# Altium project RPL_POWER.PrjPcb (part 1 of 2)
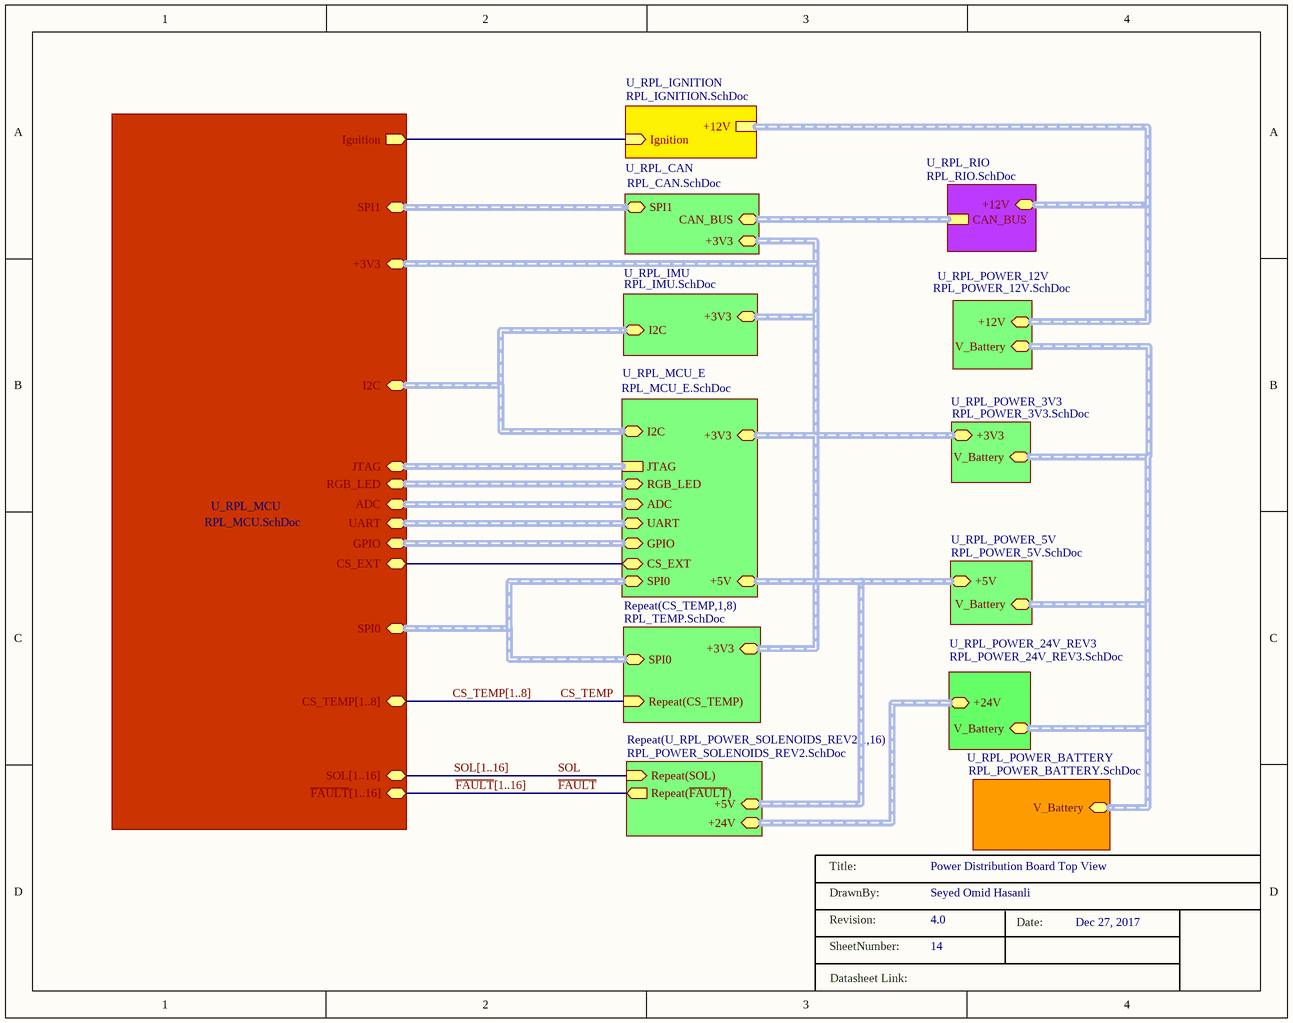
[diagram p0: RPL_MAP.SchDoc]
14 sheets, 328 parts. Net scope: hierarchical (ports join the sheet entries above them; power ports are global).
Board file: RPL_POWER.PcbDoc
Sheets:
  RPL_MAP.SchDoc
    U_RPL_POWER_24V_REV3 = RPL_POWER_24V_REV3.SchDoc
    U_RPL_POWER_3V3 = RPL_POWER_3V3.SchDoc
    U_RPL_POWER_5V = RPL_POWER_5V.SchDoc
    U_RPL_POWER_12V = RPL_POWER_12V.SchDoc
    U_RPL_MCU = RPL_MCU.SchDoc
    U_RPL_POWER_SOLENOIDS_REV21 = RPL_POWER_SOLENOIDS_REV2.SchDoc
    U_RPL_POWER_SOLENOIDS_REV22 = RPL_POWER_SOLENOIDS_REV2.SchDoc
    U_RPL_POWER_SOLENOIDS_REV23 = RPL_POWER_SOLENOIDS_REV2.SchDoc
    U_RPL_POWER_SOLENOIDS_REV24 = RPL_POWER_SOLENOIDS_REV2.SchDoc
    U_RPL_POWER_SOLENOIDS_REV25 = RPL_POWER_SOLENOIDS_REV2.SchDoc
    U_RPL_POWER_SOLENOIDS_REV26 = RPL_POWER_SOLENOIDS_REV2.SchDoc
    U_RPL_POWER_SOLENOIDS_REV27 = RPL_POWER_SOLENOIDS_REV2.SchDoc
    U_RPL_POWER_SOLENOIDS_REV28 = RPL_POWER_SOLENOIDS_REV2.SchDoc
    U_RPL_POWER_SOLENOIDS_REV29 = RPL_POWER_SOLENOIDS_REV2.SchDoc
    U_RPL_POWER_SOLENOIDS_REV210 = RPL_POWER_SOLENOIDS_REV2.SchDoc
    U_RPL_POWER_SOLENOIDS_REV211 = RPL_POWER_SOLENOIDS_REV2.SchDoc
    U_RPL_POWER_SOLENOIDS_REV212 = RPL_POWER_SOLENOIDS_REV2.SchDoc
    U_RPL_POWER_SOLENOIDS_REV213 = RPL_POWER_SOLENOIDS_REV2.SchDoc
    U_RPL_POWER_SOLENOIDS_REV214 = RPL_POWER_SOLENOIDS_REV2.SchDoc
    U_RPL_POWER_SOLENOIDS_REV215 = RPL_POWER_SOLENOIDS_REV2.SchDoc
    U_RPL_POWER_SOLENOIDS_REV216 = RPL_POWER_SOLENOIDS_REV2.SchDoc
    CS_TEMP1 = RPL_TEMP.SchDoc
    CS_TEMP2 = RPL_TEMP.SchDoc
    CS_TEMP3 = RPL_TEMP.SchDoc
    CS_TEMP4 = RPL_TEMP.SchDoc
    CS_TEMP5 = RPL_TEMP.SchDoc
    CS_TEMP6 = RPL_TEMP.SchDoc
    CS_TEMP7 = RPL_TEMP.SchDoc
    CS_TEMP8 = RPL_TEMP.SchDoc
    U_RPL_IMU = RPL_IMU.SchDoc
    U_RPL_CAN = RPL_CAN.SchDoc
    U_RPL_MCU_E = RPL_MCU_E.SchDoc
    U_RPL_POWER_BATTERY = RPL_POWER_BATTERY.SchDoc
    U_RPL_RIO = RPL_RIO.SchDoc
    U_RPL_IGNITION = RPL_IGNITION.SchDoc

## Sheet RPL_MAP.SchDoc: Power Distribution Board Top View
size A; Date: Dec 27, 2017; DrawnBy: Seyed Omid Hasanli; Revision: 4.0; SheetNumber: 14

### Sub-sheets
Repeat(CS_TEMP,1,8) = RPL_TEMP.SchDoc: Repeat(CS_TEMP) (in), +3V3 (harness +3V3), SPI0 (harness SPI0)
Repeat(U_RPL_POWER_SOLENOIDS_REV2,1,16) = RPL_POWER_SOLENOIDS_REV2.SchDoc: Repeat(SOL) (in), Repeat(~{FAULT}) (out), +5V (harness +5V), +24V (harness +24V)
U_RPL_CAN = RPL_CAN.SchDoc: CAN_BUS (harness CAN), SPI1 (harness SPI1), +3V3 (harness +3V3)
U_RPL_IGNITION = RPL_IGNITION.SchDoc: +12V (harness +12V), Ignition (in)
U_RPL_IMU = RPL_IMU.SchDoc: I2C (harness I2C), +3V3 (harness +3V3)
U_RPL_MCU = RPL_MCU.SchDoc: ~{FAULT}[1..16], SOL[1..16], CS_TEMP[1..8], UART (harness UART), JTAG (harness JTAG), ADC (harness ADC), RGB_LED (harness RGB_LED), GPIO (harness GPIO), SPI0 (harness SPI0), SPI1 (harness SPI1), I2C (harness I2C), +3V3 (harness +3V3), CS_EXT (bidir), Ignition (out)
U_RPL_MCU_E = RPL_MCU_E.SchDoc: JTAG (harness JTAG), RGB_LED (harness RGB_LED), ADC (harness ADC), UART (harness UART), CS_EXT, GPIO (harness GPIO), I2C (harness I2C), SPI0 (harness SPI0), +3V3 (harness +3V3), +5V (harness +5V)
U_RPL_POWER_3V3 = RPL_POWER_3V3.SchDoc: +3V3 (harness +3V3), V_Battery (harness V_Battery)
U_RPL_POWER_5V = RPL_POWER_5V.SchDoc: +5V (harness +5V), V_Battery (harness V_Battery)
U_RPL_POWER_12V = RPL_POWER_12V.SchDoc: +12V (harness +12V), V_Battery (harness V_Battery)
U_RPL_POWER_24V_REV3 = RPL_POWER_24V_REV3.SchDoc: +24V (harness +24V), V_Battery (harness V_Battery)
U_RPL_POWER_BATTERY = RPL_POWER_BATTERY.SchDoc: V_Battery (harness V_Battery)
U_RPL_RIO = RPL_RIO.SchDoc: CAN_BUS (harness CAN), +12V (harness +12V)

### Nets
CS_TEMP: sheet Repeat(CS_TEMP,1,8)/Repeat(CS_TEMP)
~{FAULT}: sheet Repeat(U_RPL_POWER_SOLENOIDS_REV2,1,16)/Repeat(~{FAULT})
SOL: sheet Repeat(U_RPL_POWER_SOLENOIDS_REV2,1,16)/Repeat(SOL)
NetJ1_10_3: sheet U_RPL_MCU/CS_EXT, sheet U_RPL_MCU_E/CS_EXT
NetR1_13_1: sheet U_RPL_MCU/Ignition, sheet U_RPL_IGNITION/Ignition

### Buses and harness runs
bus CS_TEMP[1..8] = sheet U_RPL_MCU/CS_TEMP[1..8]
bus SOL[1..16] = sheet U_RPL_MCU/SOL[1..16]
bus ~{FAULT}[1..16] = sheet U_RPL_MCU/~{FAULT}[1..16]
harness sheet Repeat(CS_TEMP,1,8)/+3V3 = sheet U_RPL_CAN/+3V3 = sheet U_RPL_IMU/+3V3 = sheet U_RPL_MCU/+3V3 = sheet U_RPL_MCU_E/+3V3 = sheet U_RPL_POWER_3V3/+3V3
harness sheet Repeat(CS_TEMP,1,8)/SPI0 = sheet U_RPL_MCU/SPI0 = sheet U_RPL_MCU_E/SPI0
harness sheet Repeat(U_RPL_POWER_SOLENOIDS_REV2,1,16)/+5V = sheet U_RPL_MCU_E/+5V = sheet U_RPL_POWER_5V/+5V
harness sheet Repeat(U_RPL_POWER_SOLENOIDS_REV2,1,16)/+24V = sheet U_RPL_POWER_24V_REV3/+24V
harness sheet U_RPL_CAN/CAN_BUS = sheet U_RPL_RIO/CAN_BUS
harness sheet U_RPL_CAN/SPI1 = sheet U_RPL_MCU/SPI1
harness sheet U_RPL_IGNITION/+12V = sheet U_RPL_POWER_12V/+12V = sheet U_RPL_RIO/+12V
harness sheet U_RPL_IMU/I2C = sheet U_RPL_MCU/I2C = sheet U_RPL_MCU_E/I2C
harness sheet U_RPL_MCU/ADC = sheet U_RPL_MCU_E/ADC
harness sheet U_RPL_MCU/GPIO = sheet U_RPL_MCU_E/GPIO
harness sheet U_RPL_MCU/JTAG = sheet U_RPL_MCU_E/JTAG
harness sheet U_RPL_MCU/RGB_LED = sheet U_RPL_MCU_E/RGB_LED
harness sheet U_RPL_MCU/UART = sheet U_RPL_MCU_E/UART
harness sheet U_RPL_POWER_3V3/V_Battery = sheet U_RPL_POWER_5V/V_Battery = sheet U_RPL_POWER_12V/V_Battery = sheet U_RPL_POWER_24V_REV3/V_Battery = sheet U_RPL_POWER_BATTERY/V_Battery

### Notes on the sheet
- Title:
- DrawnBy:
- Revision:
- SheetNumber:
- Date:
- Datasheet Link:

## Sheet RPL_POWER_24V_REV3.SchDoc: Boost-Buck Controller +24DC/ 3A
size A; Date: Dec 17 2017; DrawnBy: Seyed Omid Hasanli; Revision: 4.0; SheetNumber: 1
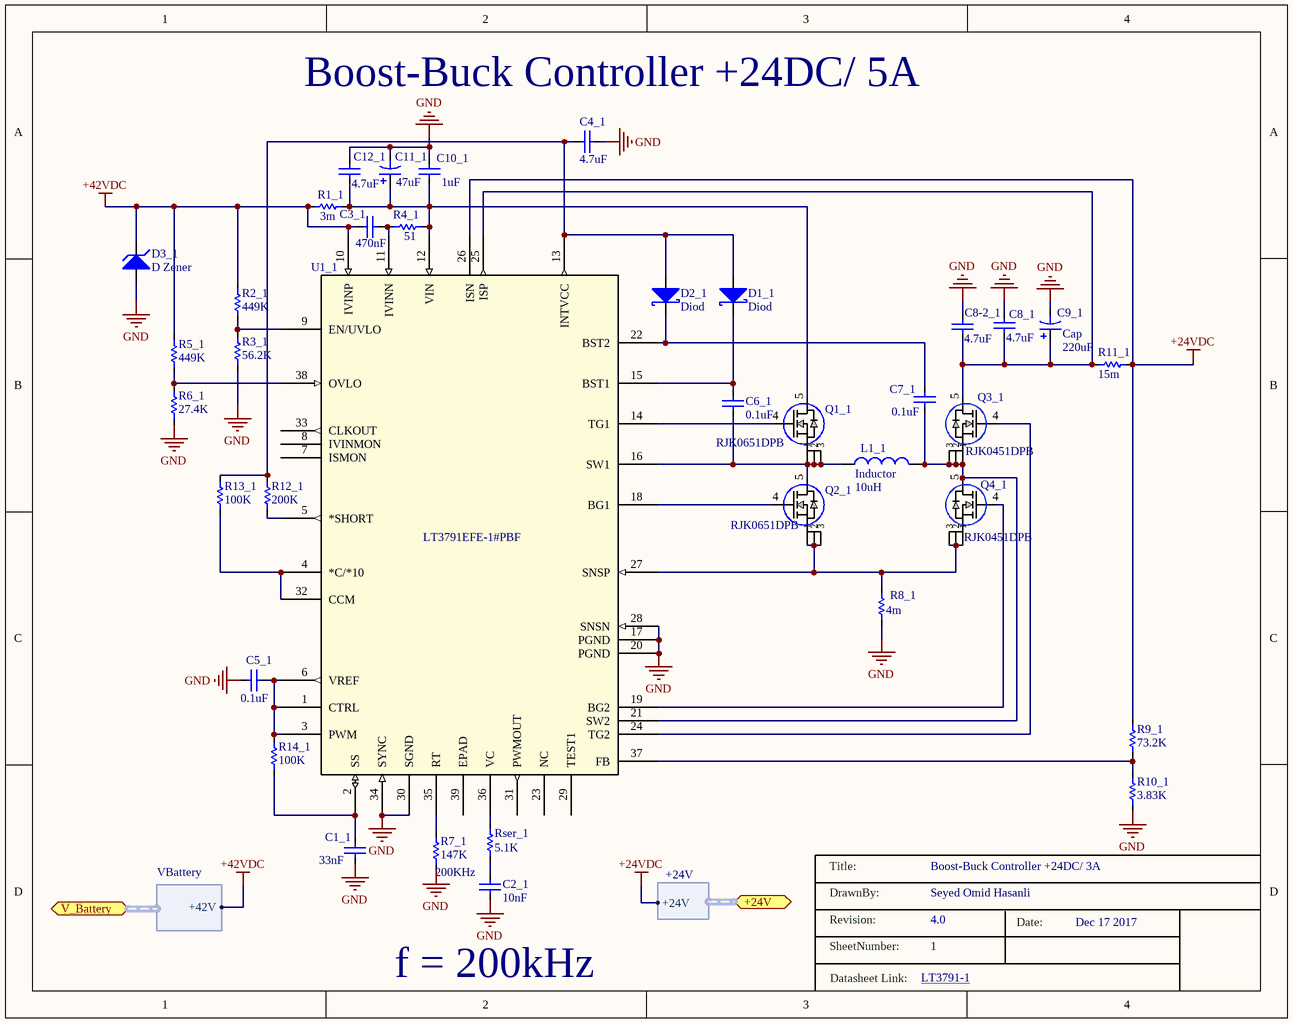
[diagram p1: RPL_POWER_24V_REV3.SchDoc]

### Parts
C1_1  value 33nF  [C1206C475K5PACTU]  (hidden comment: Cap)
C2_1  value 10nF  [C0805C475K9RACAUTO]  (hidden comment: Rser=5.1K)
C3_1  value 470nF  [C0805C475K9RACAUTO]  (hidden comment: Cap)
C4_1  value 4.7uF  [C0805C475K9RACAUTO]  (hidden comment: Cap)
C5_1  value 0.1uF  [C0805C475K9RACAUTO]  (hidden comment: Cap)
C6_1  value 0.1uF  [C0805C475K9RACAUTO]  (hidden comment: Cap)
C7_1  value 0.1uF  [C0805C475K9RACAUTO]  (hidden comment: Cap)
C8-2_1  value 4.7uF  [C1206C475K5PACTU]  (hidden comment: Cap)
C8_1  value 4.7uF  [C1206C475K5PACTU]  (hidden comment: Cap)
C9_1  Cap  value 220uF  [EEE_FK1V221AP]
C10_1  value 1uF  [C0805C475K9RACAUTO]  (hidden comment: Cap)
C11_1  value 47uF  [EEH_ZC1K470P]  (hidden comment: Cap)
C12_1  value 4.7uF  [C0805C475K9RACAUTO]  (hidden comment: Cap)
D1_1  Diod  [SODFL250X80-2N]
D2_1  Diod  [SODFL250X80-2N]
D3_1  D Zener  [SMAJ30A-TP]
L1_1  Inductor  value 10uH  [SER1360-103KLB]
Q1_1  RJK0651DPB  [LFPAK]
Q2_1  RJK0651DPB  [LFPAK]
Q3_1  RJK0451DPB  [LFPAK]
Q4_1  RJK0451DPB  [LFPAK]
R1_1  value 3m  [WSL12063L000FEA(1206)]  (hidden comment: Res)
R2_1  value 449K  [RES 0805]  (hidden comment: Res)
R3_1  value 56.2K  [RES 0805]  (hidden comment: Res)
R4_1  value 51  [RES 0805]  (hidden comment: Res)
R5_1  value 449K  [PTN1206E4993BBT1(1206)]  (hidden comment: Res)
R6_1  value 27.4K  [RES 0805]  (hidden comment: Res)
R7_1  200KHz  value 147K  [RES 0805]
R8_1  value 4m  [RES 0805]  (hidden comment: Res)
R9_1  value 73.2K  [RES 0805]  (hidden comment: Res)
R10_1  value 3.83K  [RES 0805]  (hidden comment: Res)
R11_1  value 15m  [WSL2010R0150FEA(2010)]  (hidden comment: Res)
R12_1  value 200K  [RES 0805]  (hidden comment: Res)
R13_1  value 100K  [RES 0805]  (hidden comment: Res)
R14_1  value 100K  [RES 0805]  (hidden comment: Res)
Rser_1  value 5.1K  [RES 0805]  (hidden comment: Res)
U1_1  LT3791EFE-1#PBF  [TSSOP-38_FE/AA]

### Ports
+24V (harness +24V), V_Battery (harness VBattery)

### Harnesses
VBattery: +42V
+24V: +24V

### Nets
+24VDC: R9_1.2 R11_1.2 U1_1.26(ISN) ; port +24V.+24V  [project net +24V]
+42VDC: C3_1.1 D3_1.2(K) R1_1.1 R2_1.2 R5_1.2 U1_1.10(IVINP) ; port V_Battery.+42V
GND: C1_1.1 C2_1.1 C4_1.1 C5_1.1 C8-2_1.2 C8_1.2 C9_1.2 C10_1.2 C11_1.2 C12_1.2 D3_1.1(A) R3_1.1 R6_1.1 R7_1.1 R8_1.1 R10_1.1 U1_1.17(PGND) U1_1.20(PGND) U1_1.28(SNSN) U1_1.30(SGND) U1_1.34(SYNC)
NetC1_1_2: C1_1.2 R14_1.1 U1_1.2(SS)
NetC2_1_2: C2_1.2 Rser_1.1
NetC3_1_2: C3_1.2 R4_1.1 U1_1.11(IVINN)
NetC4_1_2: C4_1.2 D1_1.1(A) D2_1.1(A) R12_1.2 R13_1.2 U1_1.13(INTVCC)
NetC5_1_2: C5_1.2 R14_1.2 U1_1.1(CTRL) U1_1.3(PWM) U1_1.6(VREF)
NetC6_1_1: C6_1.1 L1_1.1 Q1_1.1 Q1_1.2 Q1_1.3 Q2_1.5 U1_1.16(SW1)
NetC6_1_2: C6_1.2 D1_1.2(K) U1_1.15(BST1)
NetC7_1_1: C7_1.1 L1_1.2 Q3_1.1 Q3_1.2 Q3_1.3 Q4_1.5 U1_1.21(SW2)
NetC7_1_2: C7_1.2 D2_1.2(K) U1_1.22(BST2)
NetC8-2_1_1: C8-2_1.1 C8_1.1 C9_1.1 Q3_1.5 R11_1.1 U1_1.25(ISP)
NetC10_1_1: C10_1.1 C11_1.1 C12_1.1 Q1_1.5 R1_1.2 R4_1.2 U1_1.12(VIN)
NetQ1_1_4: Q1_1.4 U1_1.14(TG1)
NetQ2_1_1: Q2_1.1 Q2_1.2 Q2_1.3 Q4_1.1 Q4_1.2 Q4_1.3 R8_1.2 U1_1.27(SNSP)
NetQ2_1_4: Q2_1.4 U1_1.18(BG1)
NetQ3_1_4: Q3_1.4 U1_1.24(TG2)
NetQ4_1_4: Q4_1.4 U1_1.19(BG2)
NetR2_1_1: R2_1.1 R3_1.2 U1_1.9(EN/UVLO)
NetR5_1_1: R5_1.1 R6_1.2 U1_1.38(OVLO)
NetR7_1_2: R7_1.2 U1_1.35(RT)
NetR9_1_1: R9_1.1 R10_1.2 U1_1.37(FB)
NetR12_1_1: R12_1.1 U1_1.5(*SHORT)
NetR13_1_1: R13_1.1 U1_1.4(*C/*10) U1_1.32(CCM)
NetRser_1_2: Rser_1.2 U1_1.36(VC)

Not connected (* = marked no-connect by the designer): U1_1 7(ISMON) 8(IVINMON) 23(NC) 29(TEST1) 31(PWMOUT) 33(CLKOUT) 39(EPAD)

### Notes on the sheet
- Boost-Buck Controller +24DC/ 5A
- (near C2_1) f = 200kHz
- LT3791-1 <http://cds.linear.com/docs/en/datasheet/37911fb.pdf>
- Title:
- DrawnBy:
- Revision:
- SheetNumber:
- Date:
- Datasheet Link:

### Library data of the parts
C2_1 = Cap
C9_1 C11_1 = Cap Elec
D3_1 = D Zener: Zener Diode; Published: 8-Jun-2000; LatestRevisionDate: 17-Jul-2002; LatestRevisionNote: Re-released for DXP Platform.; PackageReference: DIODE-0.7; Publisher: Altium Limited; PackageDescription: Diode, Thru-Hole; 2 Leads; 0.7 in Pin Spacing
Q1_1 Q2_1 = RJK0651DPB-00#J5: Imported; Vendor: Renesas; VDSS_(V): 60; VGSS_(V): +/-20; ID_(A)@25C: 25; Pch(W): 45; Rds(on)@VGS: 10V,[8.0V]Max=14; QGD_(nC): 3.7; QG_(nC): 15; RG_(?): 0.7; Manufacturer_Part_Number: RJK0651DPB-00#J5; DatasheetLink: http://www.renesas.com/request?SCREEN_ID=ViewDocumentSearch&EXECUTE_ACTION=search&KEY_WORD=RJK0651DPB-00#J5; PartType: MOSFET MV; Package: LFPAK; Manufacturer_Name: Renesas; Value: Value
Q3_1 Q4_1 = RJK0451DPB-00#J5: Imported; Vendor: Renesas; VDSS_(V): 40; VGSS_(V): +/-20; ID_(A)@25C: 35; Pch(W): 45; Rds(on)@VGS: 10V,[8.0V]Max=7; QGD_(nC): 3; QG_(nC): 14; RG_(?): 0.7; Manufacturer_Part_Number: RJK0451DPB-00#J5; DatasheetLink: http://www.renesas.com/request?SCREEN_ID=ViewDocumentSearch&EXECUTE_ACTION=search&KEY_WORD=RJK0451DPB-00#J5; PartType: MOSFET MV; Package: LFPAK; Manufacturer_Name: Renesas; Value: Value
R7_1 = Res
U1_1 = LT3791EFE-1#PBF: Imported; Vendor: Linear Technology; Manufacturer_Part_Number: lt3791efe-1#pbf; Value: Value; Type: Type; RefDes: RefDes

## Sheet RPL_POWER_3V3.SchDoc: Step-Down Switching Regulater +5VDC to +3V3DC
size A; Date: Dec 17, 2017; DrawnBy: Seyed Omid Hasanli; Revision: 1.0; SheetNumber: 4
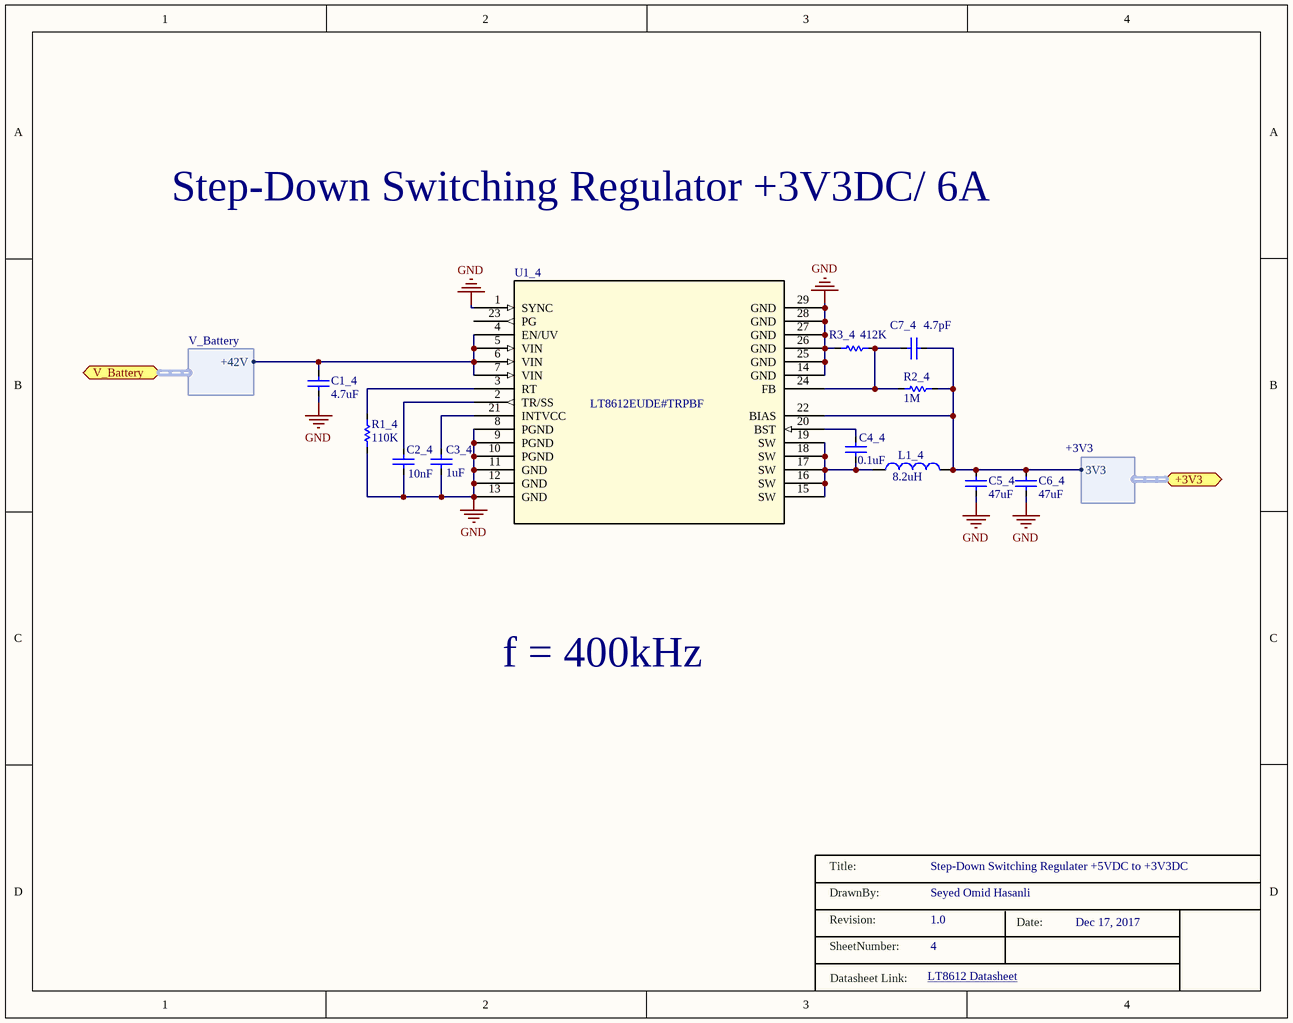
[diagram p2: RPL_POWER_3V3.SchDoc]

### Parts
C1_4  value 4.7uF  [C0805C475K9RACAUTO]  (hidden comment: Cap)
C2_4  value 10nF  [C0805C475K9RACAUTO]  (hidden comment: Cap)
C3_4  value 1uF  [C0805C475K9RACAUTO]  (hidden comment: Cap)
C4_4  value 0.1uF  [C0805C475K9RACAUTO]  (hidden comment: Cap)
C5_4  value 47uF  [C0805C475K9RACAUTO]  (hidden comment: Cap)
C6_4  value 47uF  [C0805C475K9RACAUTO]  (hidden comment: Cap)
C7_4  value 4.7pF  [C0805C475K9RACAUTO]  (hidden comment: Cap)
L1_4  value 8.2uH  [74404063082]  (hidden comment: Inductor)
R1_4  value 110K  [RES 0805]  (hidden comment: Res)
R2_4  value 1M  [RES 0805]  (hidden comment: Res)
R3_4  value 412K  [RES 0805]  (hidden comment: Res)
U1_4  LT8612EUDE#TRPBF  [QFN-28_UDE-M]

### Ports
+3V3 (harness +3V3), V_Battery (harness V_Battery)

### Harnesses
+3V3: 3V3
V_Battery: +42V

### Nets
+3V3: C5_4.2 C6_4.2 C7_4.2 L1_4.2 R2_4.2 U1_4.22(BIAS) ; port +3V3.3V3
+42VDC: C1_4.2 U1_4.4(EN/UV) U1_4.5(VIN) U1_4.6(VIN) U1_4.7(VIN) ; port V_Battery.+42V
GND: C1_4.1 C2_4.1 C3_4.1 C5_4.1 C6_4.1 R1_4.1 R3_4.2 U1_4.1(SYNC) U1_4.8(PGND) U1_4.9(PGND) U1_4.10(PGND) U1_4.11(GND) U1_4.12(GND) U1_4.13(GND) U1_4.14(GND) U1_4.25(GND) U1_4.26(GND) U1_4.27(GND) U1_4.28(GND) U1_4.29(GND)
NetC2_4_2: C2_4.2 U1_4.2(TR/SS)
NetC3_4_2: C3_4.2 U1_4.21(INTVCC)
NetC4_4_1: C4_4.1 L1_4.1 U1_4.15(SW) U1_4.16(SW) U1_4.17(SW) U1_4.18(SW) U1_4.19(SW)
NetC4_4_2: C4_4.2 U1_4.20(BST)
NetC7_4_1: C7_4.1 R2_4.1 R3_4.1 U1_4.24(FB)
NetR1_4_2: R1_4.2 U1_4.3(RT)

Not connected (* = marked no-connect by the designer): U1_4 23(PG)

### Notes on the sheet
- Step-Down Switching Regulator +3V3DC/ 6A
- f = 400kHz
- LT8612 Datasheet <http://cds.linear.com/docs/en/datasheet/8612fa.pdf>
- Title:
- DrawnBy:
- Revision:
- SheetNumber:
- Date:
- Datasheet Link:

### Library data of the parts
U1_4 = LT8612EUDE#TRPBF: Imported; Vendor: Linear Technology; Manufacturer_Part_Number: lt8612eude#trpbf; Value: Value; Type: Type; RefDes: RefDes
L1_4 = Inductor: Link: https://www.mouser.com/ProductDetail/Wurth-Electronics/74404063082/?qs=%2fha2pyFaduht0%252bnypAtgtixkbhy4PvyoSkP3FX7V6mNeXEYnZyCHyA%3d%3d

## Sheet RPL_POWER_5V.SchDoc: Step-Down Switching Regulater +12VDC to +5VDC
size A; Date: Dec 17, 2017; DrawnBy: Seyed Omid Hasanli; Revision: 1.0; SheetNumber: 3
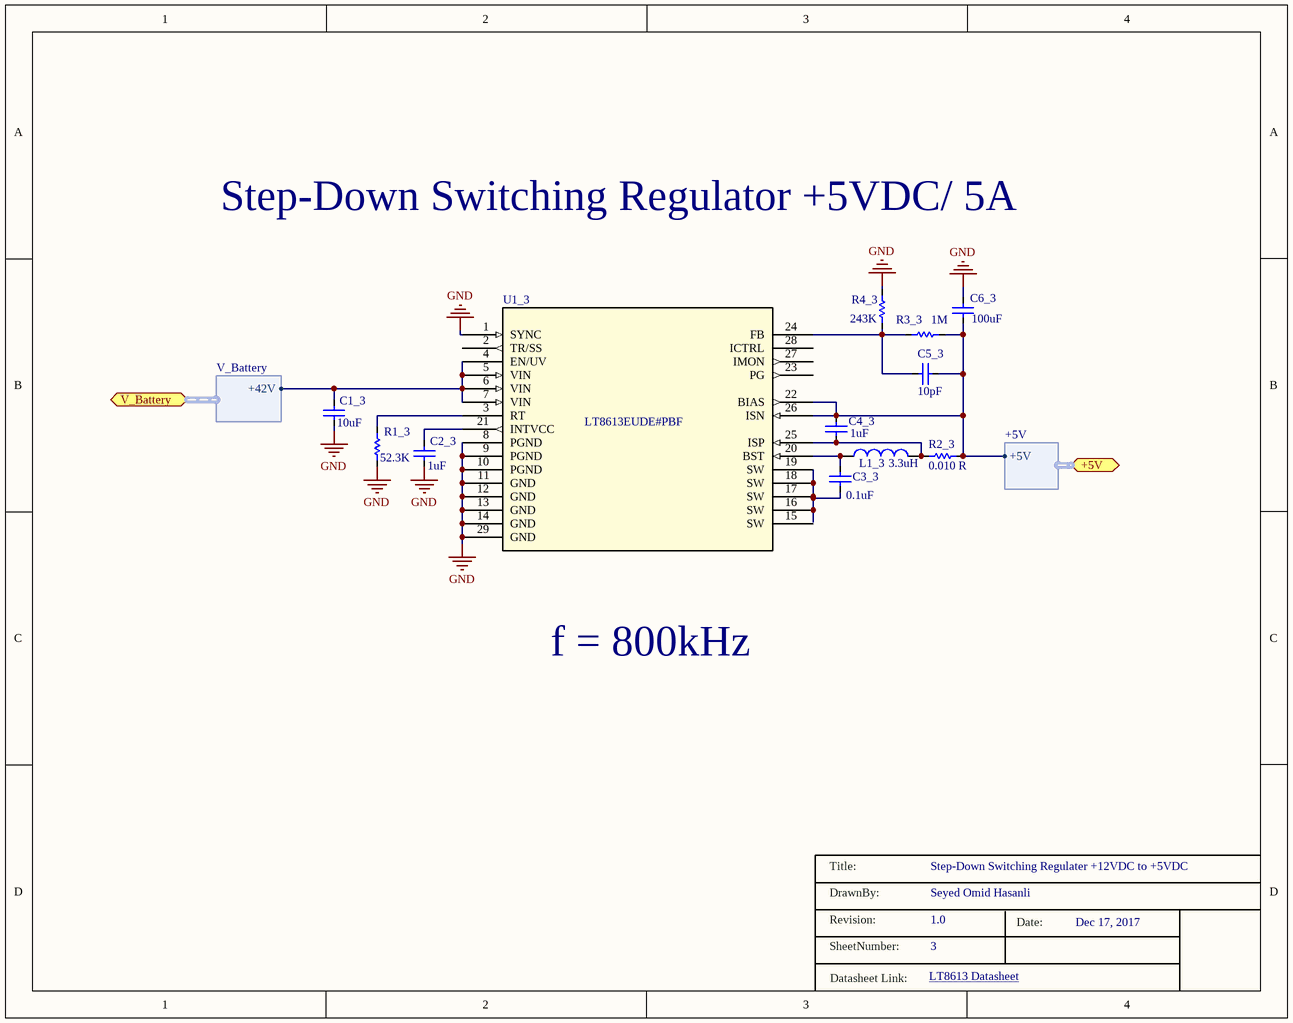
[diagram p3: RPL_POWER_5V.SchDoc]

### Parts
C1_3  value 10uF  [C0805C475K9RACAUTO]  (hidden comment: Cap)
C2_3  value 1uF  [C0805C475K9RACAUTO]  (hidden comment: Cap)
C3_3  value 0.1uF  [C0805C475K9RACAUTO]  (hidden comment: Cap)
C4_3  value 1uF  [C0805C475K9RACAUTO]  (hidden comment: Cap)
C5_3  value 10pF  [C0805C475K9RACAUTO]  (hidden comment: Cap)
C6_3  value 100uF  [C0805C475K9RACAUTO]  (hidden comment: Cap)
L1_3  value 3.3uH  [IHLP2525EZER3R3M01]  (hidden comment: VISHAY IHLP2525EZ-01)
R1_3  value 52.3K  [RES 0805]  (hidden comment: Res)
R2_3  value 0.010 R  [RES 1206]  (hidden comment: Res)
R3_3  value 1M  [RES 0805]  (hidden comment: Res)
R4_3  value 243K  [RES 0805]  (hidden comment: Res)
U1_3  LT8613EUDE#PBF  [QFN-28_UDE-L]

### Ports
+5V (harness +5V), V_Battery (harness V_Battery)

### Harnesses
+5V: +5V
V_Battery: +42V

### Nets
+5V: C4_3.1 C5_3.1 C6_3.1 R2_3.2 R3_3.2 U1_3.22(BIAS) U1_3.26(ISN) ; port +5V.+5V
+42VDC: C1_3.2 U1_3.4(EN/UV) U1_3.5(VIN) U1_3.6(VIN) U1_3.7(VIN) ; port V_Battery.+42V
GND: C1_3.1 C2_3.1 C6_3.2 R1_3.1 R4_3.2 U1_3.1(SYNC) U1_3.8(PGND) U1_3.9(PGND) U1_3.10(PGND) U1_3.11(GND) U1_3.12(GND) U1_3.13(GND) U1_3.14(GND) U1_3.29(GND)
NetC2_3_2: C2_3.2 U1_3.21(INTVCC)
NetC3_3_1: C3_3.1 U1_3.16(SW) U1_3.17(SW) U1_3.18(SW) U1_3.19(SW)
NetC3_3_2: C3_3.2 L1_3.1 U1_3.20(BST)
NetC4_3_2: C4_3.2 L1_3.2 R2_3.1 U1_3.25(ISP)
NetC5_3_2: C5_3.2 R3_3.1 R4_3.1 U1_3.24(FB)
NetR1_3_2: R1_3.2 U1_3.3(RT)

Not connected (* = marked no-connect by the designer): U1_3 2(TR/SS) 15(SW) 23(PG) 27(IMON) 28(ICTRL)

### Notes on the sheet
- Step-Down Switching Regulator +5VDC/ 5A
- f = 800kHz
- LT8613 Datasheet <http://cds.linear.com/docs/en/datasheet/8613f.pdf>
- Title:
- DrawnBy:
- Revision:
- SheetNumber:
- Date:
- Datasheet Link:

### Library data of the parts
L1_3 = Inductor: Link: https://www.mouser.com/ProductDetail/Vishay/IHLP2525EZER3R3M01/?qs=%2fha2pyFadug41qQurrvOks2uVKImTYqYAa9YdcqfxO0gtXwyeXUCX2QpKxCPAxQH
U1_3 = LT8613EUDE#PBF: Imported; Vendor: Linear Technology; Manufacturer_Part_Number: lt8613eude#pbf; Value: Value; Type: Type; RefDes: RefDes

## Sheet RPL_POWER_12V.SchDoc: Step-Down Switching Regulater +42VDC to +12VDC , 5A
size A; Date: Dec 17 2017; DrawnBy: Seyed Omid Hasanli; Revision: 1; SheetNumber: 2; Rule: PcbType=ProtelPcb
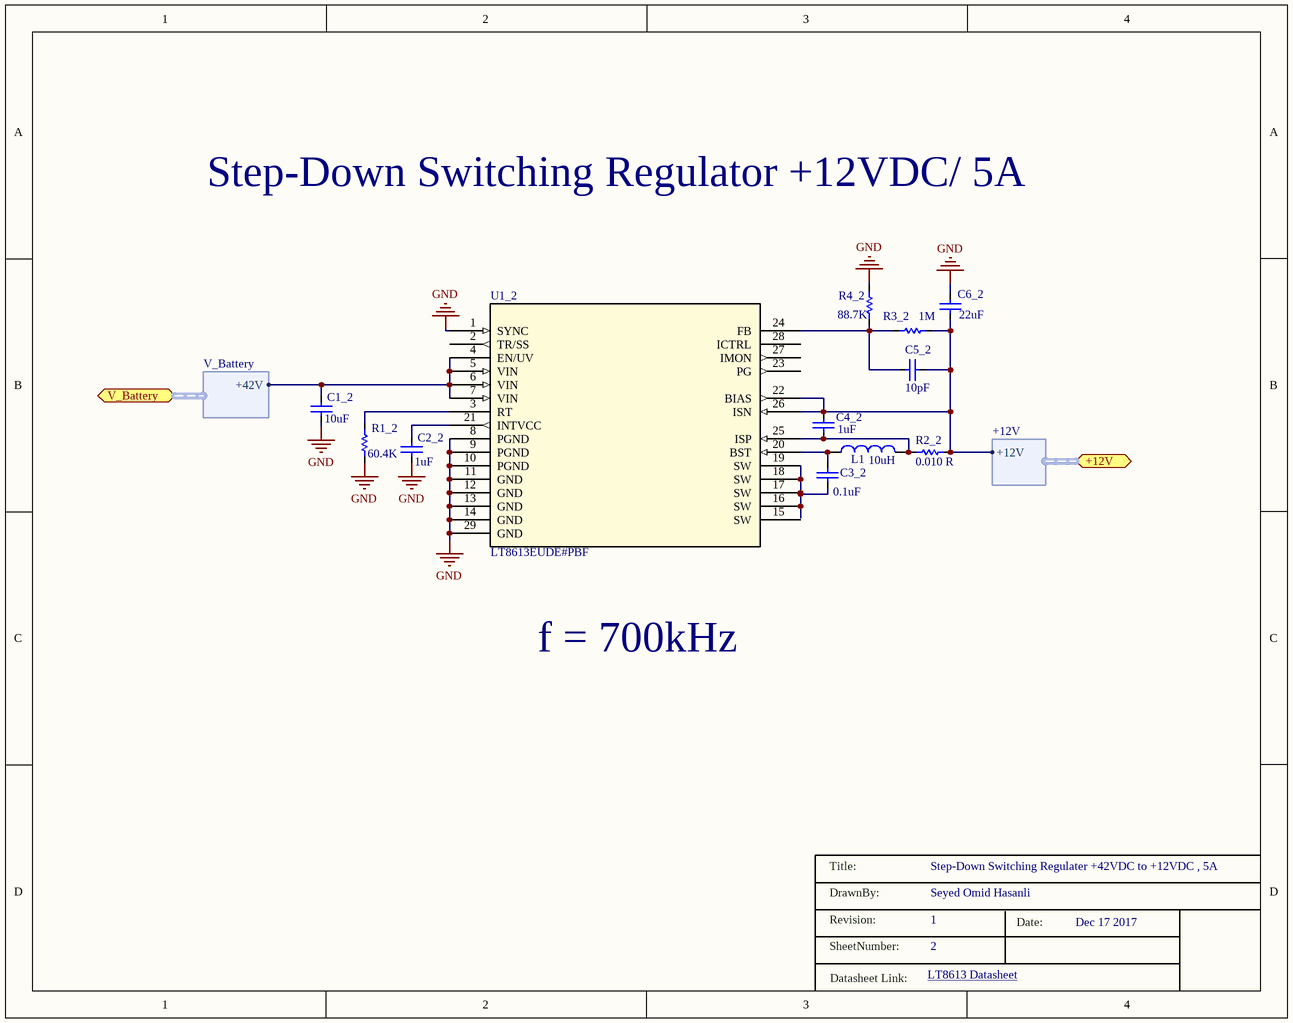
[diagram p4: RPL_POWER_12V.SchDoc]

### Parts
C1_2  value 10uF  [C0805C475K9RACAUTO]  (hidden comment: Cap)
C2_2  value 1uF  [C0805C475K9RACAUTO]  (hidden comment: Cap)
C3_2  value 0.1uF  [C0805C475K9RACAUTO]  (hidden comment: Cap)
C4_2  value 1uF  [C0805C475K9RACAUTO]  (hidden comment: Cap)
C5_2  value 10pF  [C0805C475K9RACAUTO]  (hidden comment: Cap)
C6_2  value 22uF  [C0805C475K9RACAUTO]  (hidden comment: Cap)
L1  value 10uH  [XAL6060-103MEB]  (hidden comment: COILCRAFT XAL6060)
R1_2  value 60.4K  [RES 0805]  (hidden comment: Res)
R2_2  value 0.010 R  [RES 1206]  (hidden comment: Res)
R3_2  value 1M  [RES 0805]  (hidden comment: Res)
R4_2  value 88.7K  [RES 0805]  (hidden comment: Res)
U1_2  LT8613EUDE#PBF  [QFN-28_UDE-L]

### Ports
+12V (harness +12V), V_Battery (harness V_Battery)

### Harnesses
+12V: +12V
V_Battery: +42V

### Nets
+42VDC: C1_2.2 U1_2.4(EN/UV) U1_2.5(VIN) U1_2.6(VIN) U1_2.7(VIN) ; port V_Battery.+42V
GND: C1_2.1 C2_2.1 C6_2.2 R1_2.1 R4_2.2 U1_2.1(SYNC) U1_2.8(PGND) U1_2.9(PGND) U1_2.10(PGND) U1_2.11(GND) U1_2.12(GND) U1_2.13(GND) U1_2.14(GND) U1_2.29(GND)
NetC2_2_2: C2_2.2 U1_2.21(INTVCC)
NetC3_2_1: C3_2.1 U1_2.16(SW) U1_2.17(SW) U1_2.18(SW) U1_2.19(SW)
NetC3_2_2: C3_2.2 L1.1 U1_2.20(BST)
NetC4_2_1: C4_2.1 C5_2.1 C6_2.1 R2_2.2 R3_2.2 U1_2.22(BIAS) U1_2.26(ISN) ; port +12V.+12V
NetC4_2_2: C4_2.2 L1.2 R2_2.1 U1_2.25(ISP)
NetC5_2_2: C5_2.2 R3_2.1 R4_2.1 U1_2.24(FB)
NetR1_2_2: R1_2.2 U1_2.3(RT)

Not connected (* = marked no-connect by the designer): U1_2 2(TR/SS) 15(SW) 23(PG) 27(IMON) 28(ICTRL)

### Notes on the sheet
- Step-Down Switching Regulator +12VDC/ 5A
- f = 700kHz
- LT8613 Datasheet <http://cds.linear.com/docs/en/datasheet/8613f.pdf>
- Title:
- DrawnBy:
- Revision:
- SheetNumber:
- Date:
- Datasheet Link:

### Library data of the parts
L1 = Inductor: Link: https://www.mouser.com/productdetail/coilcraft/xal6060-103meb?qs=sGAEpiMZZMsg%252by3WlYCkU2kWFds1hA9Dj%252boRsAMLw7I%3D
U1_2 = LT8613EUDE#PBF: Imported; Vendor: Linear Technology; Manufacturer_Part_Number: lt8613eude#pbf; Value: Value; Type: Type; RefDes: RefDes

## Sheet RPL_MCU.SchDoc: MCU
size A; Date: Dec 27, 2017; DrawnBy: Seyed Omid Hasanli; Revision: 3.0; SheetNumber: 6
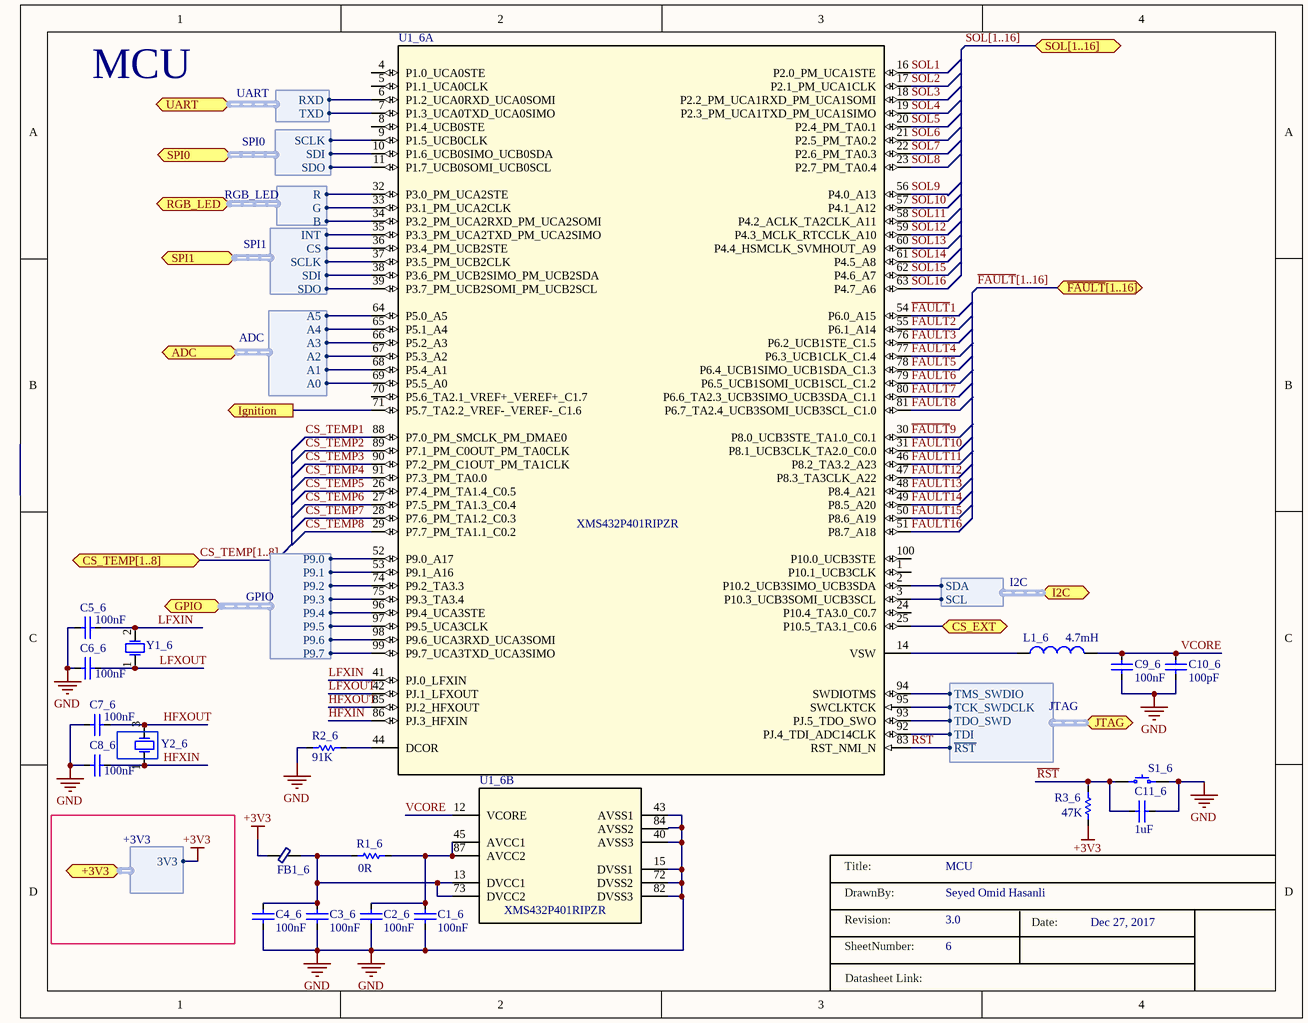
[diagram p5: RPL_MCU.SchDoc]

### Parts
C1_6  value 100nF  [C0805C475K9RACAUTO]  (hidden comment: Cap)
C2_6  value 100nF  [C0805C475K9RACAUTO]  (hidden comment: Cap)
C3_6  value 100nF  [C0805C475K9RACAUTO]  (hidden comment: Cap)
C4_6  value 100nF  [C0805C475K9RACAUTO]  (hidden comment: Cap)
C5_6  value 100nF  [C0805C475K9RACAUTO]  (hidden comment: Cap)
C6_6  value 100nF  [C0805C475K9RACAUTO]  (hidden comment: Cap)
C7_6  value 100nF  [C0805C475K9RACAUTO]  (hidden comment: Cap)
C8_6  value 100nF  [C0805C475K9RACAUTO]  (hidden comment: Cap)
C9_6  value 100nF  [C0805C475K9RACAUTO]  (hidden comment: Cap)
C10_6  value 100pF  [C0805C475K9RACAUTO]  (hidden comment: Cap)
C11_6  value 1uF  [C0805C475K9RACAUTO]  (hidden comment: Cap)
FB1_6  ferrite bead  [RES 0805]  (value not drawn)
L1_6  value 4.7mH  [INDC2016X95]  (hidden comment: Inductor)
R1_6  value 0R  [RES 0805]  (hidden comment: Res)
R2_6  value 91K  [RES 0805]  (hidden comment: Res)
R3_6  value 47K  [RES 0805]  (hidden comment: Res)
S1_6  FSMSMTR  [TE FSMSMTR]  (value not drawn)
U1_6  XMS432P401RIPZR  [PZ0100A_N]  (parts A,B of 2)
Y1_6  32.7680KHZ 12.5PF  [XTAL320X150X90]  (value not drawn)
Y2_6  48.00 MHZ 12.0PF  [OSCSC105P160X120X35-4N]  (value not drawn)

### Ports
+3V3 (harness +3V3), ADC (harness ADC), CS_EXT (bidir), CS_TEMP[1..8], GPIO (harness GPIO), I2C (harness I2C), Ignition (out), JTAG (harness JTAG), RGB_LED (harness RGB_LED), SOL[1..16], SPI0 (harness SPI0), SPI1 (harness SPI1), UART (harness UART), ~{FAULT}[1..16]

### Harnesses
I2C: SDA, SCL
UART: RXD, TXD
SPI0: SCLK, SDI, SDO
SPI1: SCLK, SDI, SDO, INT, CS
JTAG: TMS_SWDIO, TCK_SWDCLK, TDO_SWD, TDI, ~{RST}
ADC: A5, A4, A3, A2, A1, A0
RGB_LED: R, G, B
+3V3: 3V3
GPIO: P9.0, P9.1, P9.2, P9.3, P9.4, P9.5, P9.6, P9.7

### Nets
+3V3: FB1_6.1 R3_6.1 ; port +3V3.3V3
GND: C1_6.1 C2_6.1 C3_6.1 C4_6.1 C5_6.1 C6_6.1 C7_6.1 C8_6.1 C9_6.1 C10_6.1 C11_6.2 R2_6.1 S1_6.2 U1_6.15(DVSS1) U1_6.40(AVSS3) U1_6.43(AVSS1) U1_6.72(DVSS2) U1_6.82(DVSS3)
CS_TEMP1: U1_6.88(P7.0_PM_SMCLK_PM_DMAE0)
CS_TEMP2: U1_6.89(P7.1_PM_C0OUT_PM_TA0CLK)
CS_TEMP3: U1_6.90(P7.2_PM_C1OUT_PM_TA1CLK)
CS_TEMP4: U1_6.91(P7.3_PM_TA0.0)
CS_TEMP5: U1_6.26(P7.4_PM_TA1.4_C0.5)
CS_TEMP6: U1_6.27(P7.5_PM_TA1.3_C0.4)
CS_TEMP7: U1_6.28(P7.6_PM_TA1.2_C0.3)
CS_TEMP8: U1_6.29(P7.7_PM_TA1.1_C0.2)
~{FAULT}1: U1_6.54(P6.0_A15)
~{FAULT}2: U1_6.55(P6.1_A14)
~{FAULT}3: U1_6.76(P6.2_UCB1STE_C1.5)
~{FAULT}4: U1_6.77(P6.3_UCB1CLK_C1.4)
~{FAULT}5: U1_6.78(P6.4_UCB1SIMO_UCB1SDA_C1.3)
~{FAULT}6: U1_6.79(P6.5_UCB1SOMI_UCB1SCL_C1.2)
~{FAULT}7: U1_6.80(P6.6_TA2.3_UCB3SIMO_UCB3SDA_C1.1)
~{FAULT}8: U1_6.81(P6.7_TA2.4_UCB3SOMI_UCB3SCL_C1.0)
~{FAULT}9: U1_6.30(P8.0_UCB3STE_TA1.0_C0.1)
~{FAULT}10: U1_6.31(P8.1_UCB3CLK_TA2.0_C0.0)
~{FAULT}11: U1_6.46(P8.2_TA3.2_A23)
~{FAULT}12: U1_6.47(P8.3_TA3CLK_A22)
~{FAULT}13: U1_6.48(P8.4_A21)
~{FAULT}14: U1_6.49(P8.5_A20)
~{FAULT}15: U1_6.50(P8.6_A19)
~{FAULT}16: U1_6.51(P8.7_A18)
HFXIN: C8_6.2 U1_6.86(PJ.3_HFXIN) Y2_6.1(OSC1)
HFXOUT: C7_6.2 U1_6.85(PJ.2_HFXOUT) Y2_6.3(OSC3)
LFXIN: C5_6.2 U1_6.41(PJ.0_LFXIN) Y1_6.2(OSC2)
LFXOUT: C6_6.2 U1_6.42(PJ.1_LFXOUT) Y1_6.1(OSC1)
~{RST}: C11_6.1 R3_6.2 S1_6.1 U1_6.83(RST_NMI_N) ; port JTAG.~{RST}
SCL: U1_6.3(P10.3_UCB3SOMI_UCB3SCL) ; port I2C.SCL
SDA: U1_6.2(P10.2_UCB3SIMO_UCB3SDA) ; port I2C.SDA
SOL1: U1_6.16(P2.0_PM_UCA1STE)
SOL2: U1_6.17(P2.1_PM_UCA1CLK)
SOL3: U1_6.18(P2.2_PM_UCA1RXD_PM_UCA1SOMI)
SOL4: U1_6.19(P2.3_PM_UCA1TXD_PM_UCA1SIMO)
SOL5: U1_6.20(P2.4_PM_TA0.1)
SOL6: U1_6.21(P2.5_PM_TA0.2)
SOL7: U1_6.22(P2.6_PM_TA0.3)
SOL8: U1_6.23(P2.7_PM_TA0.4)
SOL9: U1_6.56(P4.0_A13)
SOL10: U1_6.57(P4.1_A12)
SOL11: U1_6.58(P4.2_ACLK_TA2CLK_A11)
SOL12: U1_6.59(P4.3_MCLK_RTCCLK_A10)
SOL13: U1_6.60(P4.4_HSMCLK_SVMHOUT_A9)
SOL14: U1_6.61(P4.5_A8)
SOL15: U1_6.62(P4.6_A7)
SOL16: U1_6.63(P4.7_A6)
VCORE: C9_6.2 C10_6.2 L1_6.2 U1_6.12(VCORE)
NetC1_6_2: C1_6.2 C2_6.2 R1_6.2 U1_6.45(AVCC1) U1_6.87(AVCC2)
NetC3_6_2: C3_6.2 C4_6.2 FB1_6.2 R1_6.1 U1_6.13(DVCC1) U1_6.73(DVCC2)
NetJ1_10_3: U1_6.25(P10.5_TA3.1_C0.6) ; port CS_EXT
NetJ1_10_4: U1_6.9(P1.5_UCB0CLK) ; port SPI0.SCLK
NetJ1_10_5: U1_6.10(P1.6_UCB0SIMO_UCB0SDA) ; port SPI0.SDI
NetJ1_10_6: U1_6.11(P1.7_UCB0SOMI_UCB0SCL) ; port SPI0.SDO
NetJ2_10_3: U1_6.6(P1.2_UCA0RXD_UCA0SOMI) ; port UART.RXD
NetJ2_10_4: U1_6.7(P1.3_UCA0TXD_UCA0SIMO) ; port UART.TXD
NetJ4_10_1: U1_6.52(P9.0_A17) ; port GPIO.P9.0
NetJ4_10_2: U1_6.53(P9.1_A16) ; port GPIO.P9.1
NetJ4_10_3: U1_6.74(P9.2_TA3.3) ; port GPIO.P9.2
NetJ4_10_4: U1_6.75(P9.3_TA3.4) ; port GPIO.P9.3
NetJ4_10_5: U1_6.96(P9.4_UCA3STE) ; port GPIO.P9.4
NetJ4_10_6: U1_6.97(P9.5_UCA3CLK) ; port GPIO.P9.5
NetJ4_10_7: U1_6.98(P9.6_UCA3RXD_UCA3SOMI) ; port GPIO.P9.6
NetJ4_10_8: U1_6.99(P9.7_UCA3TXD_UCA3SIMO) ; port GPIO.P9.7
NetL1_6_1: L1_6.1 U1_6.14(VSW)
NetP1_10_2: U1_6.94(SWDIOTMS) ; port JTAG.TMS_SWDIO
NetP1_10_4: U1_6.95(SWCLKTCK) ; port JTAG.TCK_SWDCLK
NetP1_10_6: U1_6.93(PJ.5_TDO_SWO) ; port JTAG.TDO_SWD
NetP1_10_8: U1_6.92(PJ.4_TDI_ADC14CLK) ; port JTAG.TDI
NetP2_10_1: U1_6.64(P5.0_A5) ; port ADC.A5
NetP2_10_3: U1_6.65(P5.1_A4) ; port ADC.A4
NetP2_10_5: U1_6.66(P5.2_A3) ; port ADC.A3
NetP2_10_7: U1_6.67(P5.3_A2) ; port ADC.A2
NetP2_10_9: U1_6.68(P5.4_A1) ; port ADC.A1
NetP2_10_11: U1_6.69(P5.5_A0) ; port ADC.A0
NetR1_13_1: U1_6.71(P5.7_TA2.2_VREF-_VEREF-_C1.6) ; port Ignition
NetR2_6_2: R2_6.2 U1_6.44(DCOR)
NetR2_10_1: U1_6.32(P3.0_PM_UCA2STE) ; port RGB_LED.R
NetR3_10_1: U1_6.33(P3.1_PM_UCA2CLK) ; port RGB_LED.G
NetR4_10_1: U1_6.34(P3.2_PM_UCA2RXD_PM_UCA2SOMI) ; port RGB_LED.B
NetU1_6_35: U1_6.35(P3.3_PM_UCA2TXD_PM_UCA2SIMO) ; port SPI1.INT
NetU1_6_36: U1_6.36(P3.4_PM_UCB2STE) ; port SPI1.CS
NetU1_6_37: U1_6.37(P3.5_PM_UCB2CLK) ; port SPI1.SCLK
NetU1_6_38: U1_6.38(P3.6_PM_UCB2SIMO_PM_UCB2SDA) ; port SPI1.SDI
NetU1_6_39: U1_6.39(P3.7_PM_UCB2SOMI_PM_UCB2SCL) ; port SPI1.SDO

Not connected (* = marked no-connect by the designer): U1_6 1(P10.1_UCB3CLK) 4(P1.0_UCA0STE) 5(P1.1_UCA0CLK) 8(P1.4_UCB0STE) 24(P10.4_TA3.0_C0.7) 70(P5.6_TA2.1_VREF+_VEREF+_C1.7) 84(AVSS2) 100(P10.0_UCB3STE); Y2_6 2(OSC2) 4(OSC4)

### Buses and harness runs
bus CS_TEMP[1..8] = port CS_TEMP[1..8]
bus SOL[1..16] = port SOL[1..16]
bus ~{FAULT}[1..16] = port ~{FAULT}[1..16]

### Notes on the sheet
- MCU
- Title:
- DrawnBy:
- Revision:
- SheetNumber:
- Date:
- Datasheet Link:

### Library data of the parts
S1_6 = FSMSMTR: SWITCH TACTILE SPST-NO 0.05A 24V; Manufacturer: TE Connectivity Alcoswitch Switches; Switch Function: Off-Mom; Contact Rating @ Voltage: 0.05A @ 24VDC; Actuator Type: Standard; Actuator Orientation: Top Actuated; Illumination: Non-Illuminated; Operating Force: 180gf; Switch Travel: 0.25mm; Mechanical Life: 20,000 Cycles; Part Number: FSMSMTR; PartId: 8251; Supplier 1: Digi-Key; Supplier Part Number 1: 450-1758-2-ND; ComponentLink1Description: Datasheet; ComponentLink1URL: http://www.te.com/commerce/DocumentDelivery/DDEController?Action=srchrtrv&DocNm=1437566-3&DocType=Customer+Drawing&DocLang=English; ComponentLink2Description: Digi-Key Listing; ComponentLink2URL: http://www.digikey.com/product-detail/en/FSMSMTR/450-1758-2-ND/529671; Price: 0.175; Circuit: SPST-NO; Illumination Voltage: -; Illumination Type, Colour: -; Operating Temperature: -35C ~ 85C
U1_6 = XMS432P401RIPZR: Imported; Manufacturer: Texas Instruments; CompType: IC; PIN_COUNT: 100; PartNumber: XMS432P401RIPZR; PackageReference: PZ0100A; MountType: SMT; RefDes: RefDes; TYPE: TYPE; Value: Value
Y1_6 = XTAL
Y2_6 = XTAL_4pin_16MHz_8pF

## Sheet RPL_POWER_SOLENOIDS_REV2.SchDoc: Solenoid Driver
size A; Date: Dec 27, 2017; DrawnBy: Seyed Omid Hasanli; Revision: 2.0; SheetNumber: 9
Used 16 times, as channels U_RPL_POWER_SOLENOIDS_REV21, U_RPL_POWER_SOLENOIDS_REV22, U_RPL_POWER_SOLENOIDS_REV23, U_RPL_POWER_SOLENOIDS_REV24, U_RPL_POWER_SOLENOIDS_REV25, U_RPL_POWER_SOLENOIDS_REV26, U_RPL_POWER_SOLENOIDS_REV27, U_RPL_POWER_SOLENOIDS_REV28, U_RPL_POWER_SOLENOIDS_REV29, U_RPL_POWER_SOLENOIDS_REV210, U_RPL_POWER_SOLENOIDS_REV211, U_RPL_POWER_SOLENOIDS_REV212, U_RPL_POWER_SOLENOIDS_REV213, U_RPL_POWER_SOLENOIDS_REV214, U_RPL_POWER_SOLENOIDS_REV215, U_RPL_POWER_SOLENOIDS_REV216. Parts and nets are listed once, with the designators drawn on the sheet.
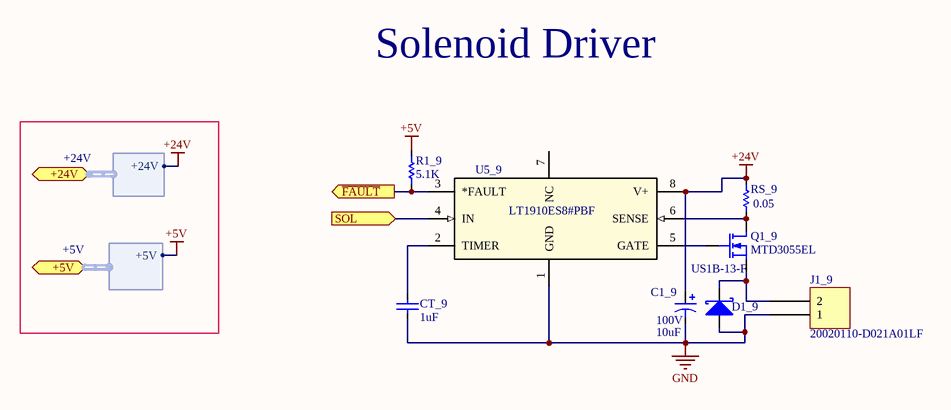
[diagram p6: RPL_POWER_SOLENOIDS_REV2.SchDoc]

### Parts
C1_9  100V  value 10uF  [(1210) CAPC3225X280]
CT_9  value 1uF  [(1210) CAPC3225X280]  (hidden comment: Cap)
D1_9  US1B-13-F  [US1B-13-F]
J1_9  20020110-D021A01LF  [FCI 06-381-2PIN]
Q1_9  MTD3055EL  [TO229P990X239-3N]
R1_9  value 5.1K  [RES 0805]  (hidden comment: Res)
RS_9  value 0.05  [RES 1206]  (hidden comment: Res)
U5_9  LT1910ES8#PBF  [SO-8_S]

### Ports
+5V (harness +5V), +24V (harness +24V), SOL (in), ~{FAULT} (out)

### Harnesses
+24V: +24V
+5V: +5V

### Nets
+5V: R1_9.2 ; port +5V.+5V
+24V: C1_9.1 RS_9.2 U5_9.8(V+) ; port +24V.+24V
GND: C1_9.2 CT_9.1 D1_9.1(A) J1_9.1 U5_9.1(GND)
~{FAULT}: R1_9.1 U5_9.3(*FAULT) ; port ~{FAULT}
SOL: U5_9.4(IN) ; port SOL
NetCT_9_2: CT_9.2 U5_9.2(TIMER)
NetD1_9_2: D1_9.2(K) J1_9.2 Q1_9.3(S)
NetQ1_9_1: Q1_9.1(D) RS_9.1 U5_9.6(SENSE)
NetQ1_9_2: Q1_9.2(G) U5_9.5(GATE)

Not connected (* = marked no-connect by the designer): U5_9 7(NC)

### Channels
U_RPL_POWER_SOLENOIDS_REV21: designators end in _U_RPL_POWER_SOLENOIDS_REV21; ports SOL=SOL1 ~{FAULT}=~{FAULT}1
U_RPL_POWER_SOLENOIDS_REV22: designators end in _U_RPL_POWER_SOLENOIDS_REV22; ports SOL=SOL2 ~{FAULT}=~{FAULT}2
U_RPL_POWER_SOLENOIDS_REV23: designators end in _U_RPL_POWER_SOLENOIDS_REV23; ports SOL=SOL3 ~{FAULT}=~{FAULT}3
U_RPL_POWER_SOLENOIDS_REV24: designators end in _U_RPL_POWER_SOLENOIDS_REV24; ports SOL=SOL4 ~{FAULT}=~{FAULT}4
U_RPL_POWER_SOLENOIDS_REV25: designators end in _U_RPL_POWER_SOLENOIDS_REV25; ports SOL=SOL5 ~{FAULT}=~{FAULT}5
U_RPL_POWER_SOLENOIDS_REV26: designators end in _U_RPL_POWER_SOLENOIDS_REV26; ports SOL=SOL6 ~{FAULT}=~{FAULT}6
U_RPL_POWER_SOLENOIDS_REV27: designators end in _U_RPL_POWER_SOLENOIDS_REV27; ports SOL=SOL7 ~{FAULT}=~{FAULT}7
U_RPL_POWER_SOLENOIDS_REV28: designators end in _U_RPL_POWER_SOLENOIDS_REV28; ports SOL=SOL8 ~{FAULT}=~{FAULT}8
U_RPL_POWER_SOLENOIDS_REV29: designators end in _U_RPL_POWER_SOLENOIDS_REV29; ports SOL=SOL9 ~{FAULT}=~{FAULT}9
U_RPL_POWER_SOLENOIDS_REV210: designators end in _U_RPL_POWER_SOLENOIDS_REV210; ports SOL=SOL10 ~{FAULT}=~{FAULT}10
U_RPL_POWER_SOLENOIDS_REV211: designators end in _U_RPL_POWER_SOLENOIDS_REV211; ports SOL=SOL11 ~{FAULT}=~{FAULT}11
U_RPL_POWER_SOLENOIDS_REV212: designators end in _U_RPL_POWER_SOLENOIDS_REV212; ports SOL=SOL12 ~{FAULT}=~{FAULT}12
U_RPL_POWER_SOLENOIDS_REV213: designators end in _U_RPL_POWER_SOLENOIDS_REV213; ports SOL=SOL13 ~{FAULT}=~{FAULT}13
U_RPL_POWER_SOLENOIDS_REV214: designators end in _U_RPL_POWER_SOLENOIDS_REV214; ports SOL=SOL14 ~{FAULT}=~{FAULT}14
U_RPL_POWER_SOLENOIDS_REV215: designators end in _U_RPL_POWER_SOLENOIDS_REV215; ports SOL=SOL15 ~{FAULT}=~{FAULT}15
U_RPL_POWER_SOLENOIDS_REV216: designators end in _U_RPL_POWER_SOLENOIDS_REV216; ports SOL=SOL16 ~{FAULT}=~{FAULT}16

### Notes on the sheet
- Solenoid Driver
- Title:
- DrawnBy:
- Revision:
- SheetNumber:
- Date:
- Datasheet Link:

### Library data of the parts
C1_9 = Cap Elec
D1_9 = Diod
J1_9 = 20020110-D021A01LF: TERM BLOCK HDR 2POS R/A 3.81MM; Manufacturer: FCI; TemperatureRange: -40C ~ 115C; Voltage: 300V; Pitch: 0.150" (3.81mm); Number Of Positions: 2; Number Of Levels: 1; Part Number: 20020110-D021A01LF; PartId: 7785; Supplier 1: Digi-Key; Supplier Part Number 1: 609-3819-ND; ComponentLink1Description: Datasheet; ComponentLink1URL: http://portal.fciconnect.com/Comergent//fci/drawing/20020110.pdf; ComponentLink2Description: Digi-Key Listing; ComponentLink2URL: http://www.digikey.ca/product-detail/en/20020110-D021A01LF/609-3819-ND/2261255; Price: 0.75; Type: Through Hole; Colour: Green; Orientation: 90, Right Angle; Positions Per Level: 2
Q1_9 = Mosfet
U5_9 = LT1910ES8#PBF: Imported; Vendor: Linear Technology; Manufacturer_Part_Number: lt1910es8#pbf; Value: Value; Type: Type; RefDes: RefDes

## Sheet RPL_TEMP.SchDoc: Tempereture Sensor Driver -200 to 300 C
size A; Date: Dec 27, 2017; DrawnBy: Seyed Omid Hasanli; Revision: 2.0; SheetNumber: 5
Used 8 times, as channels CS_TEMP1, CS_TEMP2, CS_TEMP3, CS_TEMP4, CS_TEMP5, CS_TEMP6, CS_TEMP7, CS_TEMP8. Parts and nets are listed once, with the designators drawn on the sheet.
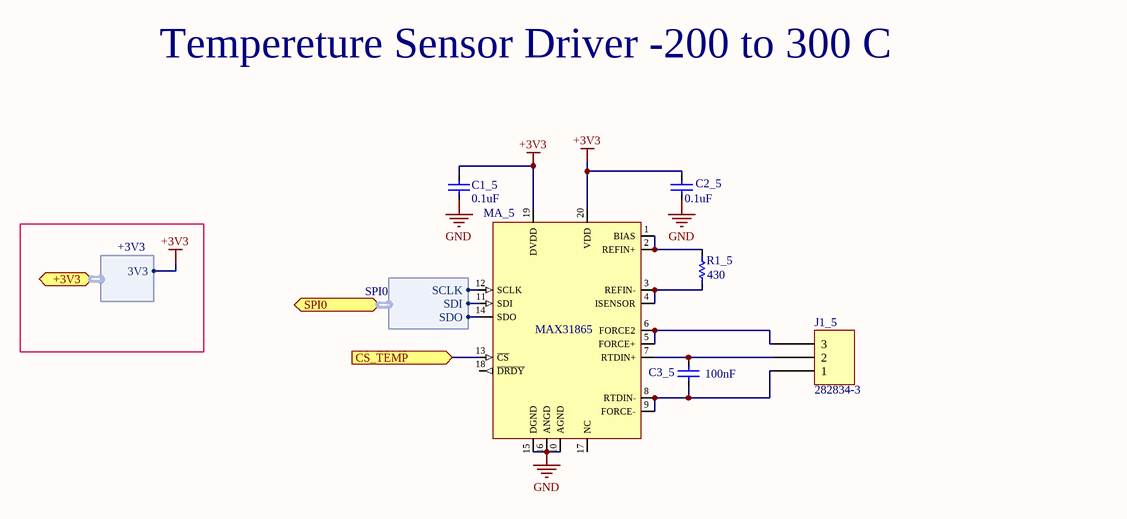
[diagram p7: RPL_TEMP.SchDoc]

### Parts
C1_5  value 0.1uF  [C0805C475K9RACAUTO]  (hidden comment: Cap)
C2_5  value 0.1uF  [C0805C475K9RACAUTO]  (hidden comment: Cap)
C3_5  value 100nF  [C0805C475K9RACAUTO]  (hidden comment: Cap)
J1_5  282834-3  [TE 282834-3]
MA_5  MAX31865  [TQFN20-EP-Maxim]
R1_5  value 430  [RES 0805]  (hidden comment: Res)

### Ports
+3V3 (harness +3V3), CS_TEMP (in), SPI0 (harness SPI0)

### Harnesses
SPI0: SCLK, SDI, SDO
+3V3: 3V3

### Nets
+3V3: C1_5.2 C2_5.2 MA_5.19(DVDD) MA_5.20(VDD) ; port +3V3.3V3
GND: C1_5.1 C2_5.1 MA_5.10(AGND) MA_5.15(DGND) MA_5.16(ANGD)
CS_TEMP: MA_5.13(~{CS}) ; port CS_TEMP
NetC3_5_1: C3_5.1 J1_5.1 MA_5.8(RTDIN-) MA_5.9(FORCE-)
NetC3_5_2: C3_5.2 J1_5.2 MA_5.7(RTDIN+)
NetJ1_5_3: J1_5.3 MA_5.5(FORCE+) MA_5.6(FORCE2)
NetMA_5_1: MA_5.1(BIAS) MA_5.2(REFIN+) R1_5.2
NetMA_5_3: MA_5.3(REFIN-) MA_5.4(ISENSOR) R1_5.1
NetMA_5_11: MA_5.11(SDI) ; port SPI0.SDI
NetMA_5_12: MA_5.12(SCLK) ; port SPI0.SCLK
NetMA_5_14: MA_5.14(SDO) ; port SPI0.SDO

Not connected (* = marked no-connect by the designer): MA_5 17(NC) 18(~{DRDY})

### Channels
CS_TEMP1: designators end in _CS_TEMP1; ports CS_TEMP=CS_TEMP1
CS_TEMP2: designators end in _CS_TEMP2; ports CS_TEMP=CS_TEMP2
CS_TEMP3: designators end in _CS_TEMP3; ports CS_TEMP=CS_TEMP3
CS_TEMP4: designators end in _CS_TEMP4; ports CS_TEMP=CS_TEMP4
CS_TEMP5: designators end in _CS_TEMP5; ports CS_TEMP=CS_TEMP5
CS_TEMP6: designators end in _CS_TEMP6; ports CS_TEMP=CS_TEMP6
CS_TEMP7: designators end in _CS_TEMP7; ports CS_TEMP=CS_TEMP7
CS_TEMP8: designators end in _CS_TEMP8; ports CS_TEMP=CS_TEMP8

### Notes on the sheet
- Tempereture Sensor Driver -200 to 300 C
- Title:
- DrawnBy:
- Revision:
- SheetNumber:
- Date:
- Datasheet Link:

### Library data of the parts
J1_5 = 282834-3: TERM BLOCK 3POS SIDE ENT 2.54MM; Manufacturer: TE Connectivity AMP Connectors; TemperatureRange: -40C ~ 105C; Voltage: 150V; Pitch: 0.100" (2.54mm); Number Of Levels: 1; Positions Per Level: 3; Part Number: 282834-3; PartId: 9290; Supplier 1: Digi-Key; Supplier Part Number 1: A98334-ND; ComponentLink1Description: Datasheet; ComponentLink1URL: http://www.te.com/commerce/DocumentDelivery/DDEController?Action=srchrtrv&DocNm=282834&DocType=Customer+Drawing&DocLang=English; ComponentLink2Description: Digi-Key Listing; ComponentLink2URL: http://www.digikey.ca/product-detail/en/282834-3/A98334-ND/1153264; Price: 2.25; Colour: Green; Orientation: Horizontal with Board
MA_5 = MAX31865: Link: *

## Sheet RPL_IMU.SchDoc: IMU
size A; Date: Dec 27, 2017; DrawnBy: Seyed Omid Hasanli; Revision: 1.0; SheetNumber: 7
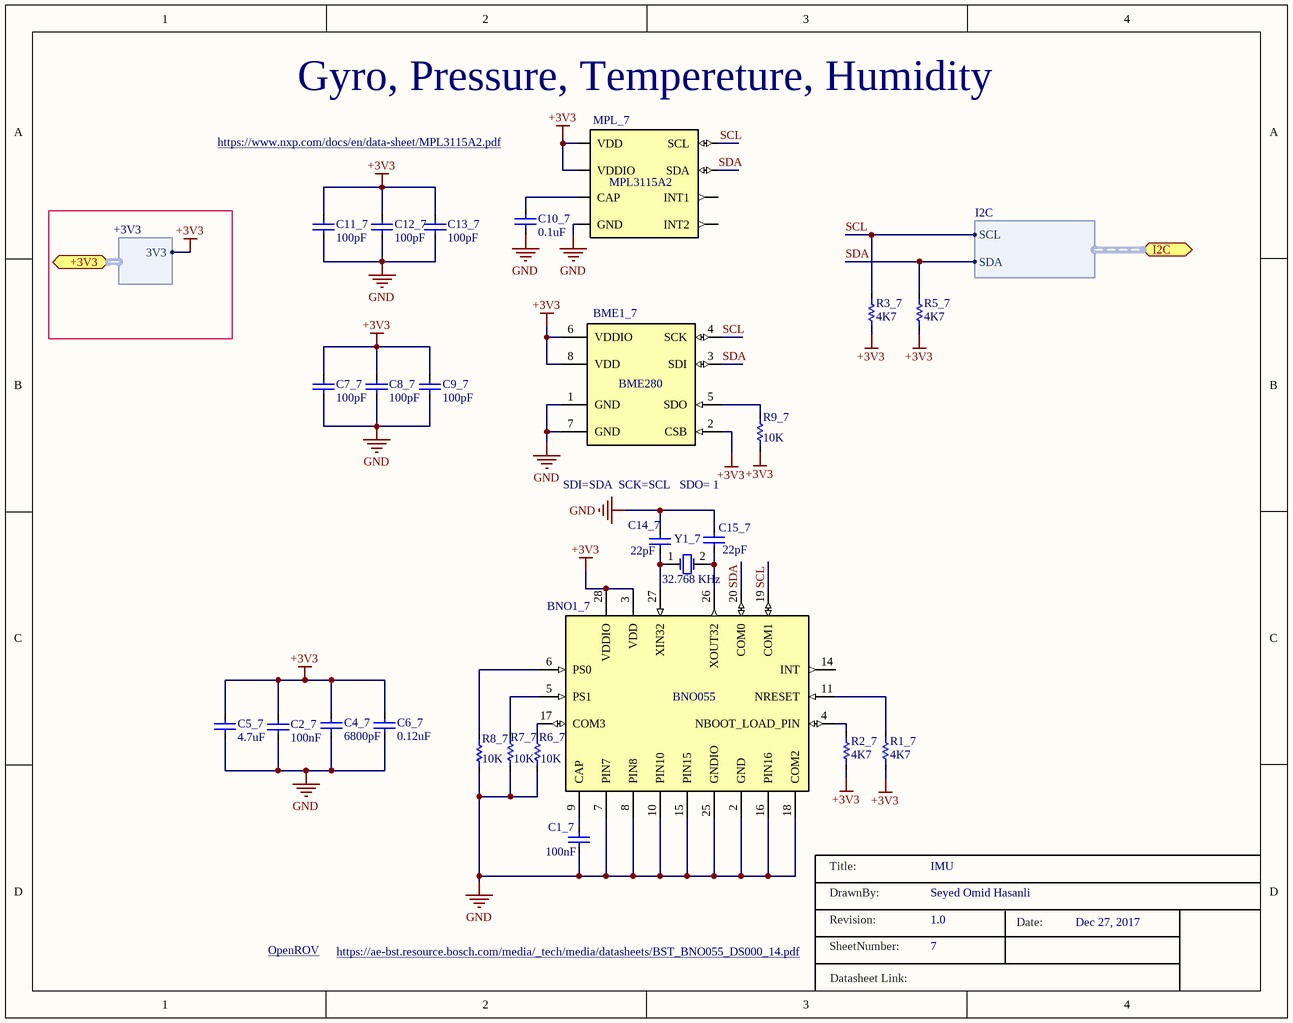
[diagram p8: RPL_IMU.SchDoc]

### Parts
BME1_7  BME280  [BME280]
BNO1_7  BNO055  [LGA28R50P4X10_380X520X100]
C1_7  value 100nF  [C0805C475K9RACAUTO]  (hidden comment: Cap)
C2_7  value 100nF  [C0805C475K9RACAUTO]  (hidden comment: Cap)
C4_7  value 6800pF  [C0805C475K9RACAUTO]  (hidden comment: Cap)
C5_7  value 4.7uF  [C0805C475K9RACAUTO]  (hidden comment: Cap)
C6_7  value 0.12uF  [C0805C475K9RACAUTO]  (hidden comment: Cap)
C7_7  value 100pF  [C0805C475K9RACAUTO]  (hidden comment: Cap)
C8_7  value 100pF  [C0805C475K9RACAUTO]  (hidden comment: Cap)
C9_7  value 100pF  [C0805C475K9RACAUTO]  (hidden comment: Cap)
C10_7  value 0.1uF  [C0805C475K9RACAUTO]  (hidden comment: Cap)
C11_7  value 100pF  [C0805C475K9RACAUTO]  (hidden comment: Cap)
C12_7  value 100pF  [C0805C475K9RACAUTO]  (hidden comment: Cap)
C13_7  value 100pF  [C0805C475K9RACAUTO]  (hidden comment: Cap)
C14_7  value 22pF  [C0805C475K9RACAUTO]  (hidden comment: Cap)
C15_7  value 22pF  [C0805C475K9RACAUTO]  (hidden comment: Cap)
MPL_7  MPL3115A2  [LGA8]
R1_7  value 4K7  [RES 0805]  (hidden comment: Res)
R2_7  value 4K7  [RES 0805]  (hidden comment: Res)
R3_7  value 4K7  [RES 0805]  (hidden comment: Res)
R5_7  value 4K7  [RES 0805]  (hidden comment: Res)
R6_7  value 10K  [RES 0805]  (hidden comment: Res)
R7_7  value 10K  [RES 0805]  (hidden comment: Res)
R8_7  value 10K  [RES 0805]  (hidden comment: Res)
R9_7  value 10K  [RES 0805]  (hidden comment: Res)
Y1_7  value 32.768 KHz  [FC-135R 32.7680KA-A3]  (hidden comment: 16MHz)

### Ports
+3V3 (harness +3V3), I2C (harness I2C)

### Harnesses
I2C: SDA, SCL
+3V3: 3V3

### Nets
+3V3: BME1_7.2(CSB) BME1_7.6(VDDIO) BME1_7.8(VDD) BNO1_7.3(VDD) BNO1_7.28(VDDIO) C2_7.2 C4_7.2 C5_7.2 C6_7.2 C7_7.2 C8_7.2 C9_7.2 C11_7.2 C12_7.2 C13_7.2 MPL_7.1(VDD) MPL_7.4(VDDIO) R1_7.1 R2_7.1 R3_7.1 R5_7.1 R9_7.1 ; port +3V3.3V3
GND: BME1_7.1(GND) BME1_7.7(GND) BNO1_7.2(GND) BNO1_7.7(PIN7) BNO1_7.8(PIN8) BNO1_7.10(PIN10) BNO1_7.15(PIN15) BNO1_7.16(PIN16) BNO1_7.18(COM2) BNO1_7.25(GNDIO) C1_7.1 C2_7.1 C4_7.1 C5_7.1 C6_7.1 C7_7.1 C8_7.1 C9_7.1 C10_7.1 C11_7.1 C12_7.1 C13_7.1 C14_7.1 C15_7.1 MPL_7.3(GND) R6_7.1 R7_7.1 R8_7.1
SCL: BME1_7.4(SCK) BNO1_7.19(COM1) MPL_7.8(SCL) R3_7.2 ; port I2C.SCL
SDA: BME1_7.3(SDI) BNO1_7.20(COM0) MPL_7.7(SDA) R5_7.2 ; port I2C.SDA
NetBME1_7_5: BME1_7.5(SDO) R9_7.2
NetBNO1_7_4: BNO1_7.4(NBOOT_LOAD_PIN) R2_7.2
NetBNO1_7_5: BNO1_7.5(PS1) R7_7.2
NetBNO1_7_6: BNO1_7.6(PS0) R8_7.2
NetBNO1_7_9: BNO1_7.9(CAP) C1_7.2
NetBNO1_7_11: BNO1_7.11(NRESET) R1_7.2
NetBNO1_7_17: BNO1_7.17(COM3) R6_7.2
NetBNO1_7_26: BNO1_7.26(XOUT32) C15_7.2 Y1_7.2(OSC2)
NetBNO1_7_27: BNO1_7.27(XIN32) C14_7.2 Y1_7.1(OSC1)
NetC10_7_2: C10_7.2 MPL_7.2(CAP)

Not connected (* = marked no-connect by the designer): BNO1_7 14(INT); MPL_7 5(INT2) 6(INT1)

### Notes on the sheet
- (near MPL_7) Gyro, Pressure, Tempereture, Humidity
- https://www.nxp.com/docs/en/data-sheet/MPL3115A2.pdf
- SDI=SDA  SCK=SCL   SDO= 1
- OpenROV <https://github.com/OpenROV/openrov-electronics/blob/master/OpenROV%20Depth:IMU%20Module%20v2%20Data%20Package/BNO055%2BMS5838BoB.v02%20Schematic.pdf>
- https://ae-bst.resource.bosch.com/media/_tech/media/datasheets/BST_BNO055_DS000_14.pdf
- Title:
- DrawnBy:
- Revision:
- SheetNumber:
- Date:
- Datasheet Link:

### Library data of the parts
BME1_7 = BME280: Integrated pressure, humidity and temperature sensor; 8-pin 2.5x2.5x0.93mm LGA; MF: Bosch; Package: LGA-8 Bosch; Availability: Good; MP: BME280; Price: 5.12 USD; Value: *
BNO1_7 = BNO055: BNO055 9-axis Absolute Orientation Sensor ( SiP ) w/Sensors and Sensor Fusion; MF: Bosch; MP: BNO055; Availability: Good; Package: LGA-28 Bosch; Price: 7.78 USD; Value: *
MPL_7 = MPL3115A2: Pressure Sensor, 50-110kpa, Lga-8; MF: NXP Semiconductors; MP: MPL3115A2; Availability: Good; Package: LGA-8 NXP Semiconductors; Price: 2.74 USD; Value: *
Y1_7 = XTAL

## Sheet RPL_CAN.SchDoc: CAN Bus Interface
size A; Date: Dec 27, 2017; DrawnBy: Seyed Omid Hasanli; Revision: 1.0; SheetNumber: 8
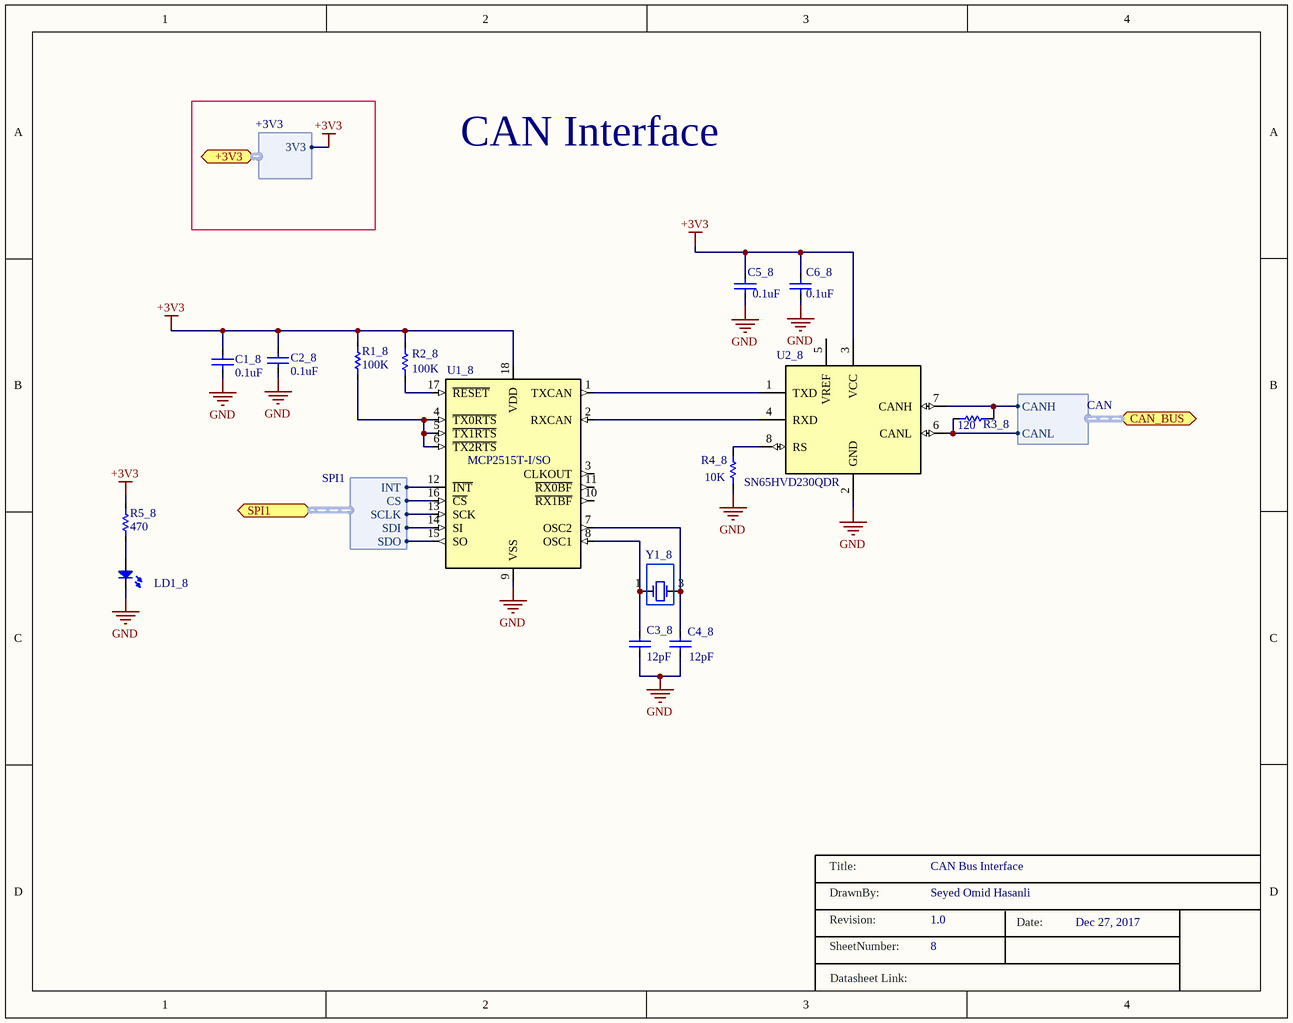
[diagram p9: RPL_CAN.SchDoc]

### Parts
C1_8  value 0.1uF  [C0805C475K9RACAUTO]  (hidden comment: Cap)
C2_8  value 0.1uF  [C0805C475K9RACAUTO]  (hidden comment: Cap)
C3_8  value 12pF  [C0805C475K9RACAUTO]  (hidden comment: Cap)
C4_8  value 12pF  [C0805C475K9RACAUTO]  (hidden comment: Cap)
C5_8  value 0.1uF  [C0805C475K9RACAUTO]  (hidden comment: Cap)
C6_8  value 0.1uF  [C0805C475K9RACAUTO]  (hidden comment: Cap)
LD1_8  LED LTST-C190GKT  [LEDM1608X80_LTST-C190GKT(Primary)]  (value not drawn)
R1_8  value 100K  [RES 0805]  (hidden comment: Res)
R2_8  value 100K  [RES 0805]  (hidden comment: Res)
R3_8  value 120  [RES 0805]  (hidden comment: Res)
R4_8  value 10K  [RES 0805]  (hidden comment: Res)
R5_8  value 470  [RES 0805]  (hidden comment: Res)
U1_8  MCP2515T-I/SO  [SOIC18-1.27-11.5X7.5MM]
U2_8  SN65HVD230QDR  [SOIC127P600X175-8N]
Y1_8  XTAL_4pin_16MHz_8pF  [OSCSC105P160X120X35-4N]  (value not drawn)

### Ports
+3V3 (harness +3V3), CAN_BUS (harness CAN), SPI1 (harness SPI1)

### Harnesses
SPI1: SCLK, SDI, SDO, INT, CS
+3V3: 3V3
CAN: CANH, CANL

### Nets
+3V3: C1_8.2 C2_8.2 C5_8.2 C6_8.2 R1_8.2 R2_8.2 R5_8.1 U1_8.18(VDD) U2_8.3(VCC) ; port +3V3.3V3
GND: C1_8.1 C2_8.1 C3_8.2 C4_8.2 C5_8.1 C6_8.1 LD1_8.C R4_8.1 U1_8.9(VSS) U2_8.2(GND)
NetC3_8_1: C3_8.1 U1_8.8(OSC1) Y1_8.1(OSC1)
NetC4_8_1: C4_8.1 U1_8.7(OSC2) Y1_8.3(OSC3)
NetJ1_1: R3_8.1 U2_8.7(CANH) ; port CAN_BUS.CANH
NetJ1_2: R3_8.2 U2_8.6(CANL) ; port CAN_BUS.CANL
NetLD1_8_A: LD1_8.A R5_8.2
NetR1_8_1: R1_8.1 U1_8.4(~{TX0RTS}) U1_8.5(~{TX1RTS}) U1_8.6(~{TX2RTS})
NetR2_8_1: R2_8.1 U1_8.17(~{RESET})
NetR4_8_2: R4_8.2 U2_8.8(RS)
NetU1_6_35: U1_8.12(~{INT}) ; port SPI1.INT
NetU1_6_36: U1_8.16(~{CS}) ; port SPI1.CS
NetU1_6_37: U1_8.13(SCK) ; port SPI1.SCLK
NetU1_6_38: U1_8.14(SI) ; port SPI1.SDI
NetU1_8_1: U1_8.1(TXCAN) U2_8.1(TXD)
NetU1_8_2: U1_8.2(RXCAN) U2_8.4(RXD)

Not connected (* = marked no-connect by the designer): U1_8 3(CLKOUT) 10(~{RX1BF}) 11(~{RX0BF}) 15(SO); U2_8 5(VREF); Y1_8 2(OSC2) 4(OSC4)

### Notes on the sheet
- CAN Interface
- Title:
- DrawnBy:
- Revision:
- SheetNumber:
- Date:
- Datasheet Link:

### Library data of the parts
LD1_8 = LED LTST-C190GKT: Green 1.6 x 0.8 x 0.8 mm 130Â° Water Clear 6 mcd 2.1 V SMT LED; MF: Lite-On; Price: 0.06 USD; MP: LTST-C190GKT; Availability: Good; Package: 0603 Lite-On; Value: *
U1_8 = MCP2515T-I/SO (SOIC18): MCP2515 Series 5.5 V 1 Mb/s Stand Alone SPI Interface CAN Controller- SOIC-18; MF: Microchip; Package: SOIC-18 Microchip; Availability: Good; MP: MCP2515T-I/SO; Price: 1.63 USD; Value: *
U2_8 = SN65HVD230QDR: 3.3-V CAN Transceiver with Standby Mode 8-SOIC -40 to 125; MF: Texas Instruments; Package: SOIC-8 Texas Instruments; Availability: Good; MP: SN65HVD230QDR; Price: 1.74 USD; Value: *

## Sheet RPL_MCU_E.SchDoc: MCU Breakouts
size A; Date: Dec 27,2017; DrawnBy: Seyed Omid Hasanli; Revision: 1.0; SheetNumber: 10
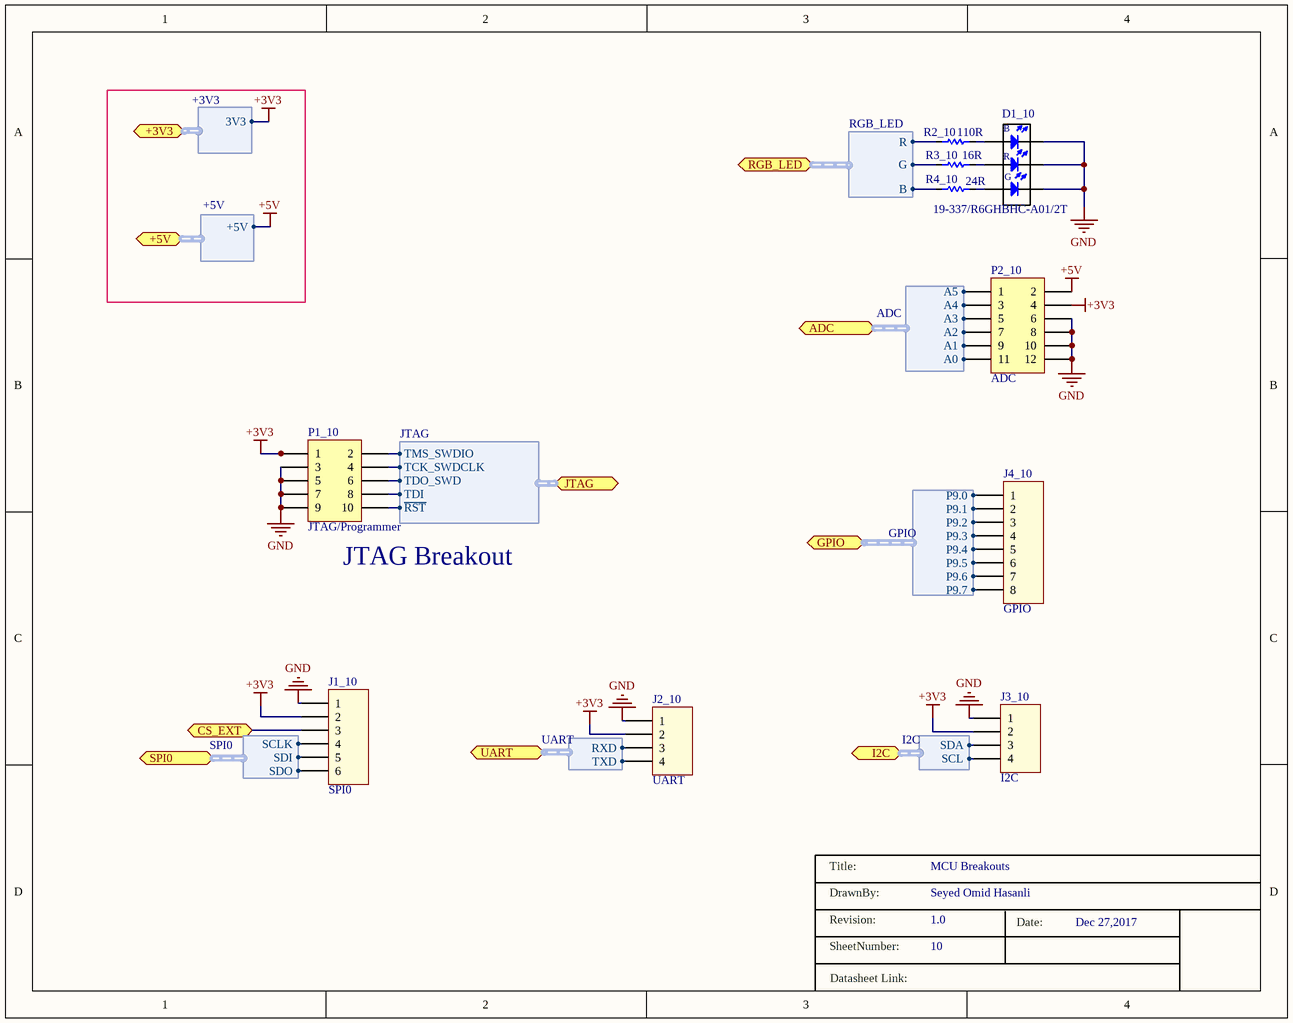
[diagram p10: RPL_MCU_E.SchDoc]

### Parts
D1_10  19-337/R6GHBHC-A01/2T  [LED_19-337/R6GHBHC-A01/2T]
J1_10  SPI0  [665306124022]
J2_10  UART  [665104131822]
J3_10  I2C  [665104131822]
J4_10  GPIO  [665308124022]
P1_10  JTAG/Programmer  [FTSH-105-01-XXX-D-K]
P2_10  ADC  [HDR2X6]
R2_10  value 110R  [RES 0805]  (hidden comment: Res)
R3_10  value 16R  [RES 0805]  (hidden comment: Res)
R4_10  value 24R  [RES 0805]  (hidden comment: Res)

### Ports
+3V3 (harness +3V3), +5V (harness +5V), ADC (harness ADC), CS_EXT, GPIO (harness GPIO), I2C (harness I2C), JTAG (harness JTAG), RGB_LED (harness RGB_LED), SPI0 (harness SPI0), UART (harness UART)

### Harnesses
JTAG: TMS_SWDIO, TCK_SWDCLK, TDO_SWD, TDI, ~{RST}
RGB_LED: R, G, B
+3V3: 3V3
ADC: A5, A4, A3, A2, A1, A0
+5V: +5V
SPI0: SCLK, SDI, SDO
UART: RXD, TXD
I2C: SDA, SCL
GPIO: P9.0, P9.1, P9.2, P9.3, P9.4, P9.5, P9.6, P9.7

### Nets
+3V3: J1_10.2 J2_10.2 J3_10.2 P1_10.1 P2_10.4 ; port +3V3.3V3
+5V: P2_10.2 ; port +5V.+5V
GND: D1_10.1(C1) D1_10.2(C2) D1_10.3(C3) J1_10.1 J2_10.1 J3_10.1 P1_10.3 P1_10.5 P1_10.7 P1_10.9 P2_10.6 P2_10.8 P2_10.10 P2_10.12
~{RST}: P1_10.10 ; port JTAG.~{RST}
SCL: J3_10.4 ; port I2C.SCL
SDA: J3_10.3 ; port I2C.SDA
NetD1_10_4: D1_10.4(A1) R2_10.2
NetD1_10_5: D1_10.5(A2) R3_10.2
NetD1_10_6: D1_10.6(A3) R4_10.2
NetJ1_10_3: J1_10.3 ; port CS_EXT
NetJ1_10_4: J1_10.4 ; port SPI0.SCLK
NetJ1_10_5: J1_10.5 ; port SPI0.SDI
NetJ1_10_6: J1_10.6 ; port SPI0.SDO
NetJ2_10_3: J2_10.3 ; port UART.RXD
NetJ2_10_4: J2_10.4 ; port UART.TXD
NetJ4_10_1: J4_10.1 ; port GPIO.P9.0
NetJ4_10_2: J4_10.2 ; port GPIO.P9.1
NetJ4_10_3: J4_10.3 ; port GPIO.P9.2
NetJ4_10_4: J4_10.4 ; port GPIO.P9.3
NetJ4_10_5: J4_10.5 ; port GPIO.P9.4
NetJ4_10_6: J4_10.6 ; port GPIO.P9.5
NetJ4_10_7: J4_10.7 ; port GPIO.P9.6
NetJ4_10_8: J4_10.8 ; port GPIO.P9.7
NetP1_10_2: P1_10.2 ; port JTAG.TMS_SWDIO
NetP1_10_4: P1_10.4 ; port JTAG.TCK_SWDCLK
NetP1_10_6: P1_10.6 ; port JTAG.TDO_SWD
NetP1_10_8: P1_10.8 ; port JTAG.TDI
NetP2_10_1: P2_10.1 ; port ADC.A5
NetP2_10_3: P2_10.3 ; port ADC.A4
NetP2_10_5: P2_10.5 ; port ADC.A3
NetP2_10_7: P2_10.7 ; port ADC.A2
NetP2_10_9: P2_10.9 ; port ADC.A1
NetP2_10_11: P2_10.11 ; port ADC.A0
NetR2_10_1: R2_10.1 ; port RGB_LED.R
NetR3_10_1: R3_10.1 ; port RGB_LED.G
NetR4_10_1: R4_10.1 ; port RGB_LED.B

### Notes on the sheet
- (near P1_10) JTAG Breakout
- Title:
- DrawnBy:
- Revision:
- SheetNumber:
- Date:
- Datasheet Link:
- (in symbol LED 19-337/R6GHBHC-A01/2T) B; R; G

### Library data of the parts
D1_10 = LED 19-337/R6GHBHC-A01/2T: LED Tri-Color Blue/Green/Red 468nm/518nm/632nm 6-Pin T/R; MF: Everlight; Package: SMD-2 Everlight; Price: 0.17 USD; MP: 19-337/R6GHBHC-A01/2T; Availability: Good; Value: *
J1_10 = 665306124022: WR-WTB 1.00 mm SMT Male Vertical Shrouded Header, 6p; Pitch: 1 mm; Pin Number: 6; ComponentLink1Description: Manufacturer; ComponentLink1URL: http://www.we-online.de; ComponentLink2Description: Datasheet; ComponentLink2URL: http://katalog.we-online.de/em/datasheet/6653xx124022.pdf; Part Number: 665306124022; Published Date: June 2017; Publisher: Wurth Elektronik
J2_10 J3_10 = 665104131822: WR-WTB 1.00 mm SMT Male Horizontal Shrouded, 4p; Pitch: 1 mm; Pin Number: 4; ComponentLink1Description: Manufacturer; ComponentLink1URL: http://www.we-online.de; ComponentLink2Description: Datasheet; ComponentLink2URL: http://katalog.we-online.de/em/datasheet/6651xx131822.pdf; Part Number: 665104131822; Published Date: June 2017; Publisher: Wurth Elektronik
J4_10 = 665308124022: WR-WTB 1.00 mm SMT Male Vertical Shrouded Header, 8p; Pitch: 1 mm; Pin Number: 8; ComponentLink1Description: Manufacturer; ComponentLink1URL: http://www.we-online.de; ComponentLink2Description: Datasheet; ComponentLink2URL: http://katalog.we-online.de/em/datasheet/6653xx124022.pdf; Part Number: 665308124022; Published Date: June 2017; Publisher: Wurth Elektronik
P1_10 = Header 5X2: Header, 5-Pin, Dual row; LatestRevisionDate: 17-Jul-2002; LatestRevisionNote: Re-released for DXP Platform.; Publisher: Altium Limited
P2_10 = Header 6X2: Header, 6-Pin, Dual row; LatestRevisionDate: 17-Jul-2002; LatestRevisionNote: Re-released for DXP Platform.; Publisher: Altium Limited

## Sheet RPL_POWER_BATTERY.SchDoc: Battery and Charger Breakouts
size A; Date: Dec 27, 2017; DrawnBy: Seyed Omid Hasanli; Revision: 1.0; SheetNumber: 12
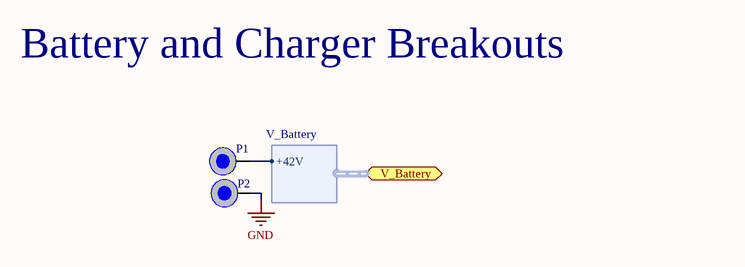
[diagram p11: RPL_POWER_BATTERY.SchDoc]

### Parts
P1  Single Port  [12AWG]  (value not drawn)
P2  Single Port  [12AWG]  (value not drawn)

### Ports
V_Battery (harness V_Battery)

### Harnesses
V_Battery: +42V

### Nets
+42VDC: P1.1 ; port V_Battery.+42V
GND: P2.1

### Notes on the sheet
- Battery and Charger Breakouts
- Title:
- DrawnBy:
- Revision:
- SheetNumber:
- Date:
- Datasheet Link:

## Sheet RPL_RIO.SchDoc: RIO's Breakout (CAN BUS, +12VDC)
size A; Date: Dec 27, 2017; DrawnBy: Seyed Omid Hasanli; Revision: 1.0; SheetNumber: 11
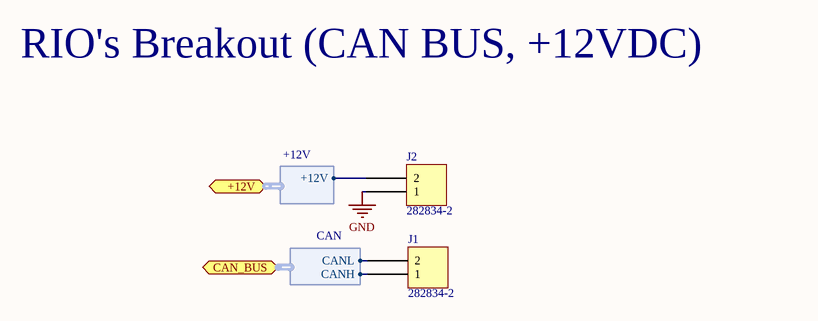
[diagram p12: RPL_RIO.SchDoc]

### Parts
J1  282834-2  [TE 282834-2]
J2  282834-2  [TE 282834-2]

### Ports
+12V (harness +12V), CAN_BUS (harness CAN)

### Harnesses
+12V: +12V
CAN: CANH, CANL

### Nets
GND: J2.1
NetC4_2_1: J2.2 ; port +12V.+12V
NetJ1_1: J1.1 ; port CAN_BUS.CANH
NetJ1_2: J1.2 ; port CAN_BUS.CANL

### Notes on the sheet
- RIO's Breakout (CAN BUS, +12VDC)
- Title:
- DrawnBy:
- Revision:
- SheetNumber:
- Date:
- Datasheet Link:

### Library data of the parts
J1 J2 = 282834-2: TERM BLOCK 2POS SIDE ENT 2.54MM; Manufacturer: TE Connectivity AMP Connectors; TemperatureRange: -40C ~ 105C; Voltage: 150V; Pitch: 0.100" (2.54mm); Number Of Levels: 1; Positions Per Level: 2; Part Number: 282834-2; PartId: 9289; Supplier 1: Digi-Key; Supplier Part Number 1: A98333-ND; ComponentLink1Description: Datasheet; ComponentLink1URL: http://www.te.com/commerce/DocumentDelivery/DDEController?Action=srchrtrv&DocNm=282834&DocType=Customer+Drawing&DocLang=English; ComponentLink2Description: Digi-Key Listing; ComponentLink2URL: http://www.digikey.ca/product-detail/en/282834-2/A98333-ND/1150135; Price: 1.3; Colour: Green; Orientation: Horizontal with Board

## Sheet RPL_IGNITION.SchDoc: Ignition
size A; Date: Dec 27, 2017; DrawnBy: Seyed Omid Hasanli; Revision: 1.0; SheetNumber: 13
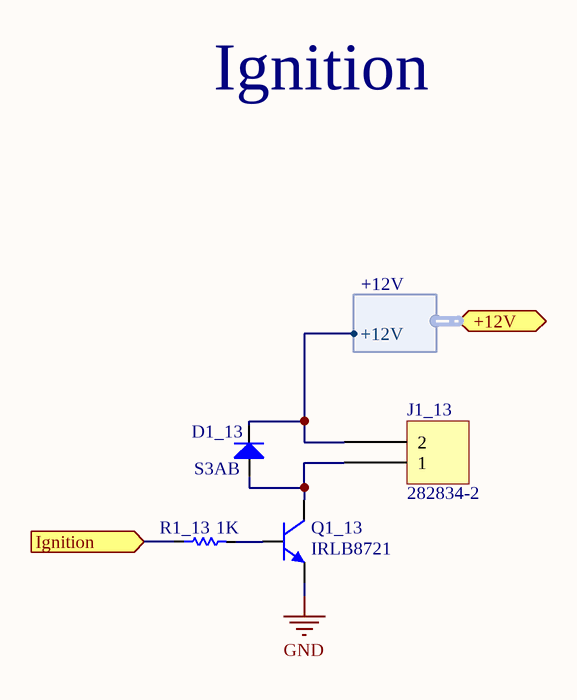
[diagram p13: RPL_IGNITION.SchDoc]

### Parts
D1_13  S3AB  [S3AB]
J1_13  282834-2  [TE 282834-2]
Q1_13  IRLB8721  [TO220]
R1_13  value 1K  [RES 0805]  (hidden comment: Res)

### Ports
+12V (harness +12V), Ignition (in)

### Harnesses
+12V: +12V

### Nets
GND: Q1_13.1(E)
NetC4_2_1: D1_13.K J1_13.2 ; port +12V.+12V
NetD1_13_A: D1_13.A J1_13.1 Q1_13.3(C)
NetQ1_13_2: Q1_13.2(B) R1_13.2
NetR1_13_1: R1_13.1 ; port Ignition

### Notes on the sheet
- Ignition
- Title:
- DrawnBy:
- Revision:
- SheetNumber:
- Date:
- Datasheet Link:

### Library data of the parts
D1_13 = Diod Rectifire: Link: https://www.mouser.com/productdetail/on-semiconductor-fairchild/s3ab?qs=sGAEpiMZZMtbRapU8LlZD8eZ1FFRrq3pn%2FcN8IJzN01nfWZFKw516g%3D%3D
J1_13 = 282834-2: as J1 on sheet RPL_RIO; Part Number: 282834-2; PartId: 9289; Supplier 1: Digi-Key; Supplier Part Number 1: A98333-ND; ComponentLink1Description: Datasheet; ComponentLink1URL: http://www.te.com/commerce/DocumentDelivery/DDEController?Action=srchrtrv&DocNm=282834&DocType=Customer+Drawing&DocLang=English; ComponentLink2Description: Digi-Key Listing; ComponentLink2URL: http://www.digikey.ca/product-detail/en/282834-2/A98333-ND/1150135; Price: 1.3; Colour: Green; Orientation: Horizontal with Board
Q1_13 = IRLB8721: NPN General Purpose Amplifier; Link: https://www.digikey.com/products/en?keywords=%20IRLB8721%20